# EasyEDA Pro project AWTRIX2.0_SHELD.eprj

# Schematic SHELD
Create Date: 2023-08-30; Page Name: P1; Project Name: AWTRIX2.0_SHELD; Schematic Name: SHELD; Update Date: 2023-10-06; Company: 🍊实验室; Drawed: CH; Page Size: A4; Version: V1.0
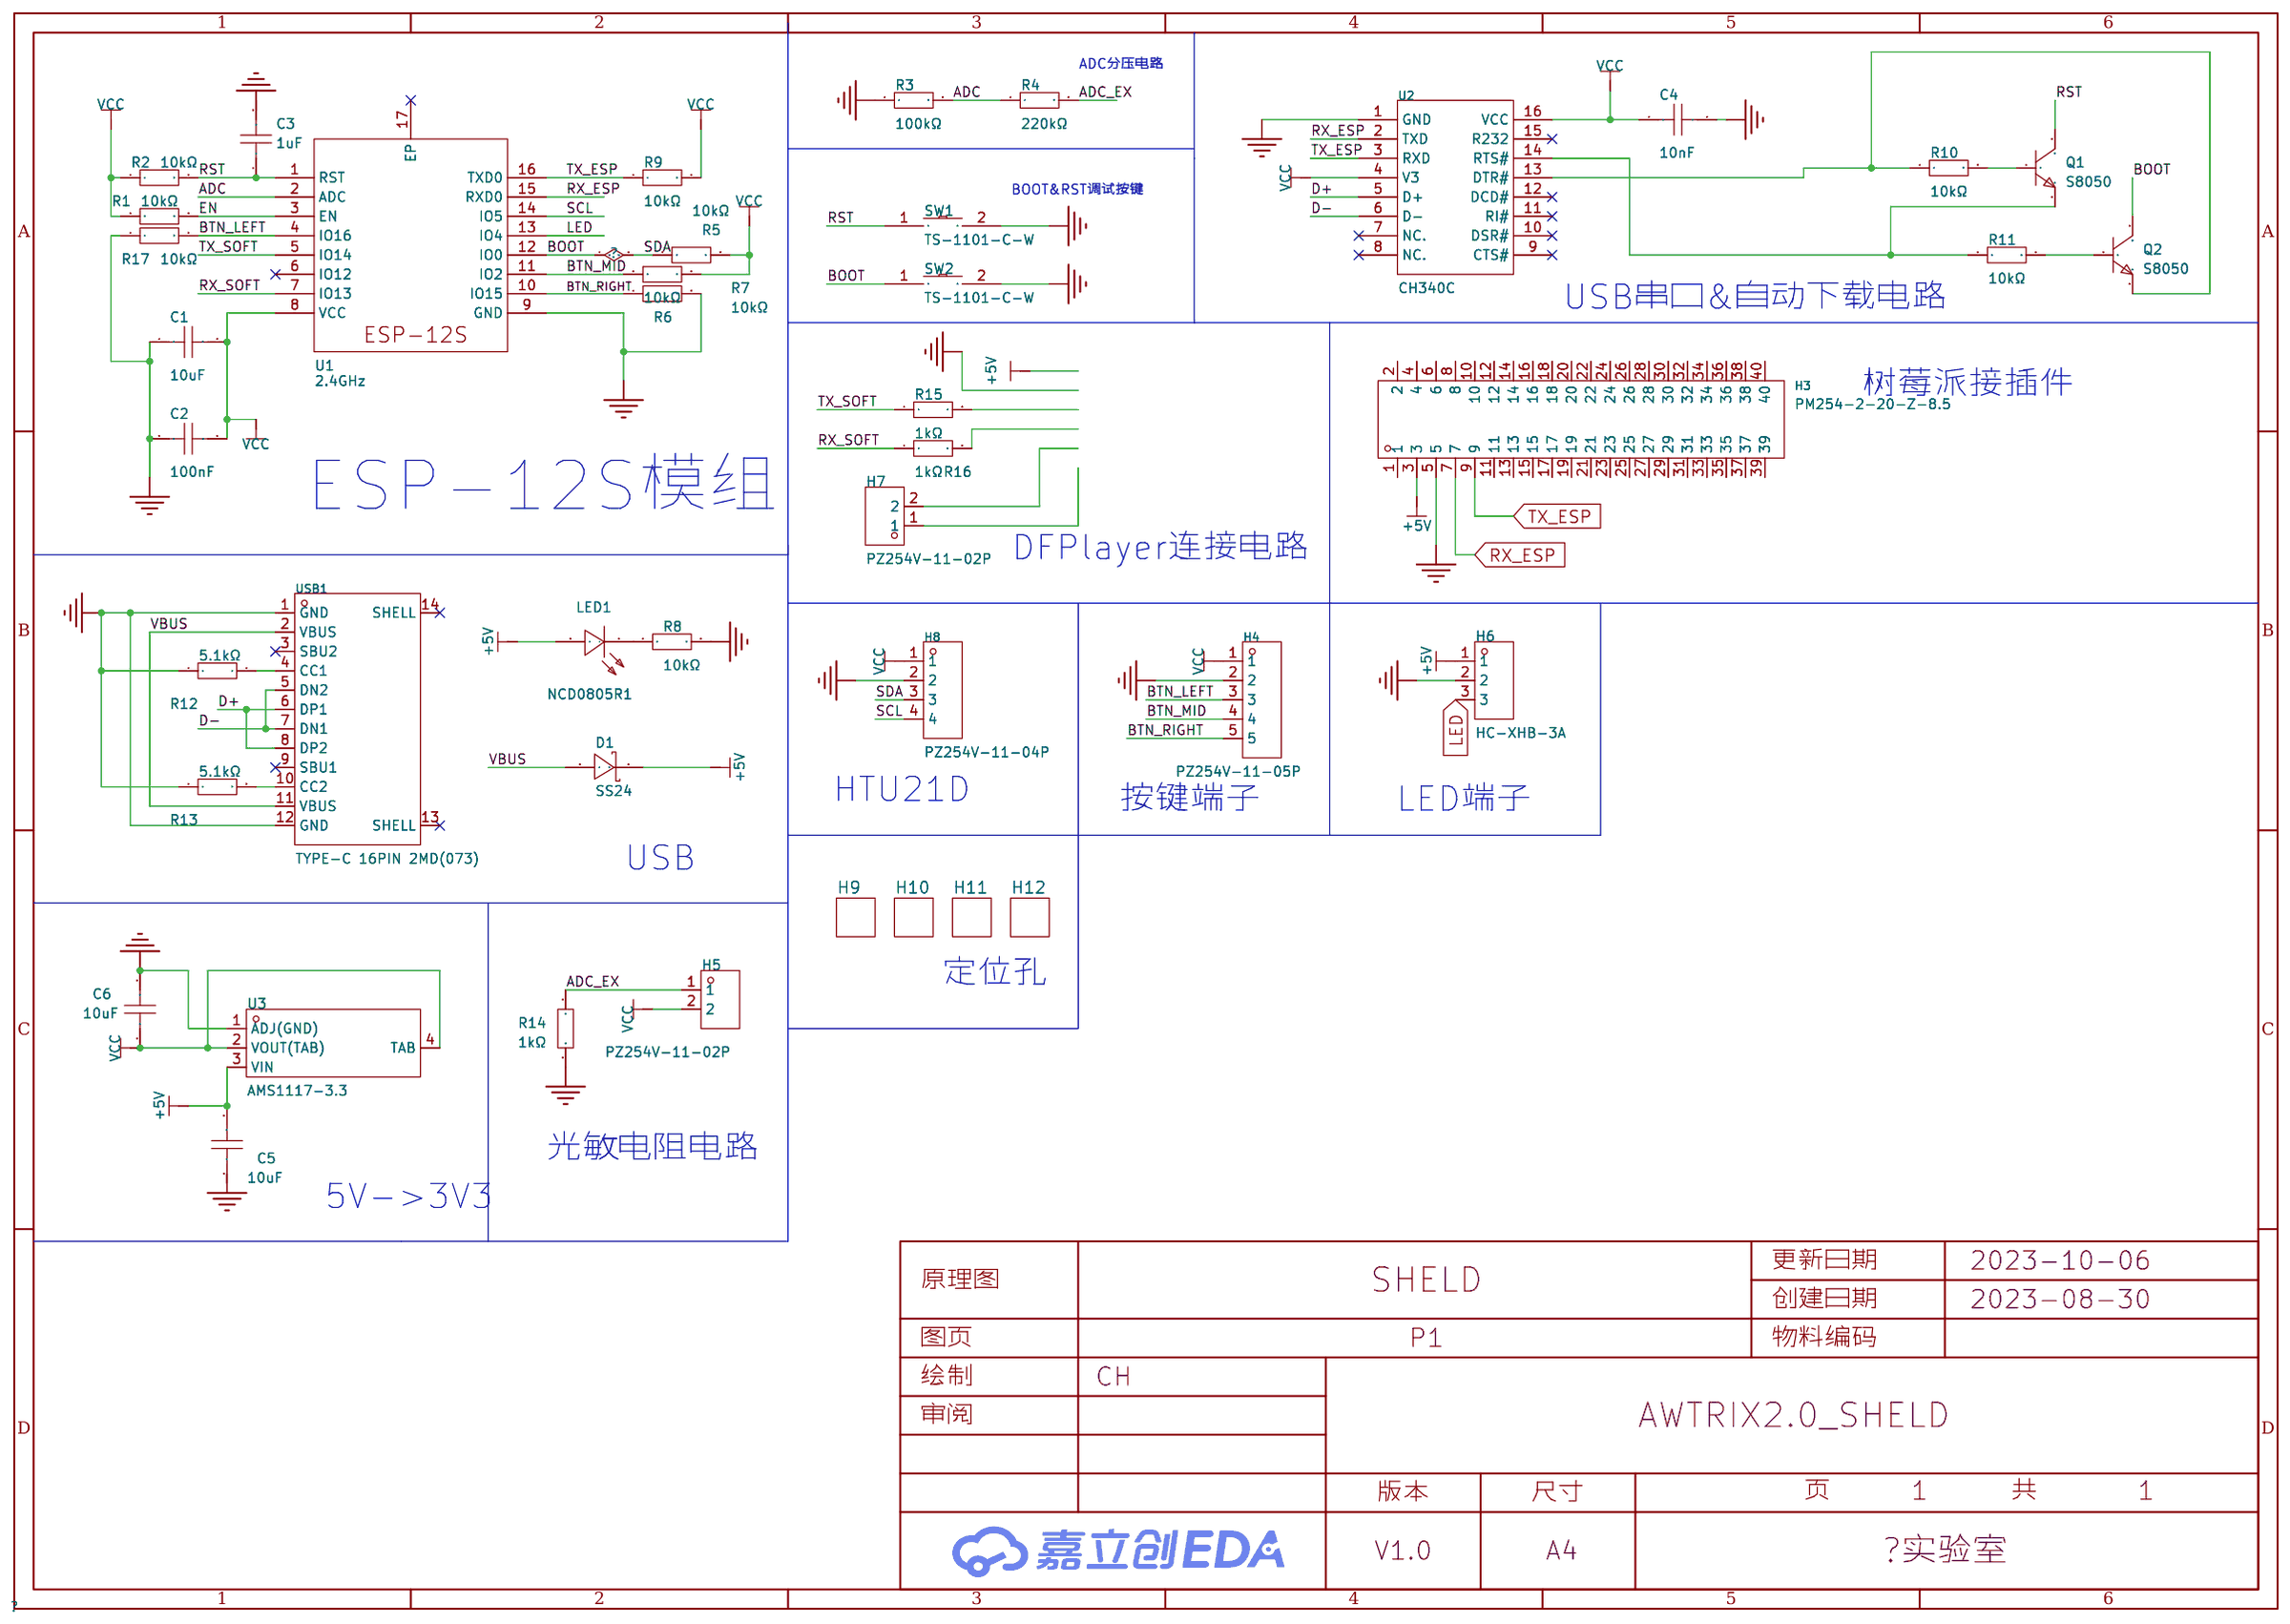
[diagram p0: schematic sheet]

## Parts
C1  10uF  [C0603]
C2  100nF  [C0603]
C3  1uF  [C0603]
C4  10nF  [C0603]
C5  10uF  [C0603]
C6  10uF  [C0603]
CBB1  9cfe7b9adb7f4373a9c1c3f971ab27d0
D1  SS24  [SMA_L4.3-W2.6-LS5.2-RD]
H3  PM254-2-20-Z-8.5  [HDR-TH_40P-P2.54-V-F-R2-C20-S2.54]
H4  PZ254V-11-05P  [HDR-TH_5P-P2.54-V-M]
H5  PZ254V-11-02P  [HDR-TH_2P-P2.54-V-M]
H6  HC-XHB-3A  [CONN-TH_3P-P2.50_HC-XHB-3AKK]
H7  PZ254V-11-02P  [HDR-TH_2P-P2.54-V-M]
H8  PZ254V-11-04P  [HDR-TH_4P-P2.54-V-M]
H9  Hole-3mm-JK 孔  [HOLE-3MM]
H10  Hole-3mm-JK 孔  [HOLE-3MM]
H11  Hole-3mm-JK 孔  [HOLE-3MM]
H12  Hole-3mm-JK 孔  [HOLE-3MM]
LED1  NCD0805R1  [LED0805-RD_RED]
Q1  S8050  [SOT-23-3_L2.9-W1.6-P1.90-LS2.8-BR]
Q2  S8050  [SOT-23-3_L2.9-W1.6-P1.90-LS2.8-BR]
R1  10kΩ  [R0603]
R2  10kΩ  [R0603]
R3  100kΩ  [R0603]
R4  220kΩ  [R0603]
R5  10kΩ  [R0603]
R6  10kΩ  [R0603]
R7  10kΩ  [R0603]
R8  10kΩ  [R0603]
R9  10kΩ  [R0603]
R10  10kΩ  [R0603]
R11  10kΩ  [R0603]
R12  5.1kΩ  [R0603]
R13  5.1kΩ  [R0603]
R14  1kΩ  [R0603]
R15  1kΩ  [R0603]
R16  1kΩ  [R0603]
R17  10kΩ  [R0603]
SW1  TS-1101-C-W  [SW-SMD_L6.0-W3.3-LS8.0]
SW2  TS-1101-C-W  [SW-SMD_L6.0-W3.3-LS8.0]
U1  2.4GHz  [WIRELM-SMD_ESP-12S]
U2  CH340C  [SOP-16_L10.0-W3.9-P1.27-LS6.0-BL]
U3  AMS1117-3.3  [SOT-223-4_L6.5-W3.5-P2.30-LS7.0-BR]
USB1  TYPE-C 16PIN 2MD(073)  [USB-C-SMD_TYPE-C-6PIN-2MD-073]

## Library data of the parts
C1 C5 C6 = CL10A106KP8NNNC: 容值:10uF;精度:±10%;额定电压:10V;材质(温度系数):X5R;; LCSC Part Name: 10uF ±10% 10V; Supplier Part: C19702; Manufacturer: SAMSUNG(三星); Supplier Footprint: 0603; JLCPCB Part Class: Basic Part; Datasheet: https://atta.szlcsc.com/upload/public/pdf/source/20160103/1457707703378.pdf; Supplier: LCSC; Tolerance: ±10%; Voltage Rated: 10V; Temperature Coefficient: X5R
C2 = 0603B104K500NT: 容值:100nF;精度:±10%;额定电压:50V;材质(温度系数):X7R;; LCSC Part Name: 100nF ±10% 50V; Supplier Part: C30926; Manufacturer: FH(风华); Supplier Footprint: 0603; JLCPCB Part Class: Extended Part; Datasheet: https://atta.szlcsc.com/upload/public/pdf/source/20170923/C30926_1506149436298988724.pdf; Supplier: LCSC; Tolerance: ±10%; Voltage Rated: 50V; Temperature Coefficient: X7R
C3 = CL10A105KB8NNNC: 容值:1uF;精度:±10%;额定电压:50V;材质(温度系数):X5R;; LCSC Part Name: 1uF ±10% 50V; Supplier Part: C15849; Manufacturer: SAMSUNG(三星); Supplier Footprint: 0603; JLCPCB Part Class: Basic Part; Datasheet: https://atta.szlcsc.com/upload/public/pdf/source/20160103/1457707679084.pdf; Supplier: LCSC; Tolerance: ±10%; Voltage Rated: 50V; Temperature Coefficient: X5R
C4 = CT41G-0603-2X1-50V-0.01μF-K(N): 容值:10nF;精度:±10%;额定电压:50V;材质(温度系数):2X1;; LCSC Part Name: 10nF ±10% 50V; Supplier Part: C136131; Manufacturer: TORCH(火炬); Supplier Footprint: 0603; JLCPCB Part Class: Extended Part; Datasheet: https://atta.szlcsc.com/upload/public/pdf/source/20180104/C136131_15150388659201227415.pdf; Supplier: LCSC; Tolerance: ±10%; Voltage Rated: 50V; Temperature Coefficient: 2X1
D1 = SS24_C50645: 直流反向耐压(Vr):40V;平均整流电流(Io):2A;正向压降(Vf):550mV@2A;; LCSC Part Name: 40V 2A 550mV@2A SMA （相似料：C364270）; Supplier Part: C50645; Manufacturer: MDD; Supplier Footprint: SMA(DO-214AC); JLCPCB Part Class: 扩展库; Datasheet: https://atta.szlcsc.com/upload/public/pdf/source/20190304/C50645_5B6F2047F1B1EB9F2588B24BC6E81306.pdf; Supplier: LCSC; Reverse Voltage (Vr): 40V; Average Rectified Current (Io): 2A; Forward Voltage (Vf@If): 550mV@2A
H3 = PM254-2-20-Z-8.5: 排数:双排;总孔位数:40;间距:2.54mm;插孔结构:2x20P;行距:2.54mm;安装类型:直插;圆孔/方孔:方孔;额定电流:3A;额定电压:-;插孔方向:顶部;塑高:8.5mm;工作温度范围:-40℃~+105℃;; LCSC Part Name: 2.54mm 2x20P; Supplier Part: C2897421; Manufacturer: HCTL(华灿天禄); Supplier Footprint: 插件,P=2.54mm; JLCPCB Part Class: Extended Part; Datasheet: 2022-08-29/478875C/7532653a59ec4ab7a85cccb09c462b49/2X20PIN排针.pdf; Supplier: LCSC; Number of Rows: 双排; Number of Holes: 40; Pitch: 2.54mm; Holes Structure: 2x20P; Row Spacing: 2.54mm; Mounting Type: 直插; Circular Hole / Square Hole: 方孔; Current Rating (Max): 3A; Holes Direction: 顶部; Insulation Height: 8.5mm; Operating Temperature Range: -40℃~+105℃; Number of Pins: 40; Pin Structure: 2x20P; Circluar Pins/Square Pins: 方针; Length of Mating Pin: 6mm; Length of End Connection Pin: 3mm; Color: 黑色
H4 = PZ254V-11-05P: 排数:单排;总PIN位数:5P;间距:2.54mm;插针结构:1x5P;行距:-;安装类型:直插;圆针/方针:方针;额定电流:-;额定电压:-;配合针长度:6mm;塑高:2.5mm;端接针长度:3mm;触头材质:黄铜;触头镀层:-;工作温度范围:-40℃~+105℃;颜色:黑色;; LCSC Part Name: 2.54mm 1x5P 直插 方针; Supplier Part: C492404; Manufacturer: XFCN(兴飞); Supplier Footprint: 插件,P=2.54mm; JLCPCB Part Class: Extended Part; Datasheet: https://atta.szlcsc.com/upload/public/pdf/source/20200309/C492404_E51533260F8710EFF5D4617281164C1D.pdf; Supplier: LCSC; Number of Rows: 单排; Number of Pins: 5P; Pitch: 2.54mm; Pin Structure: 1x5P; Mounting Type: 直插; Circluar Pins/Square Pins: 方针; Length of Mating Pin: 6mm; Insulation Height: 2.5mm; Length of End Connection Pin: 3mm; Contact Material: 黄铜; Operating Temperature Range: -40℃~+105℃; Color: 黑色
H5 H7 = PZ254V-11-02P: 排数:单排;总PIN位数:2P;间距:2.54mm;插针结构:1x2P;行距:-;安装类型:直插;圆针/方针:方针;额定电流:-;额定电压:-;配合针长度:6mm;塑高:2.5mm;端接针长度:3mm;触头材质:黄铜;触头镀层:-;工作温度范围:-40℃~+105℃;颜色:黑色;; LCSC Part Name: 2.54mm 1x2P 直插 方针; Supplier Part: C492401; Manufacturer: XFCN(兴飞); Supplier Footprint: 插件,P=2.54mm; JLCPCB Part Class: Extended Part; Datasheet: https://atta.szlcsc.com/upload/public/pdf/source/20200309/C492401_A812433581A9B211A7FFA413ADDFF0E5.pdf; Supplier: LCSC; Number of Rows: 单排; Number of Pins: 2P; Pitch: 2.54mm; Pin Structure: 1x2P; Mounting Type: 直插; Circluar Pins/Square Pins: 方针; Length of Mating Pin: 6mm; Insulation Height: 2.5mm; Length of End Connection Pin: 3mm; Contact Material: 黄铜; Operating Temperature Range: -40℃~+105℃; Color: 黑色
H6 = HC-XHB-3A: 间距:2.5mm;插针结构:1x3P;排数:1;每排PIN数:3;公母:公型插针;安装方式:直插;额定电流:3A;工作温度范围:-25℃~+85℃;; LCSC Part Name: 2.5mm 1x3P 直插 带锁扣立式插件 3P; Supplier Part: C3011963; Manufacturer: HCTL(华灿天禄); Supplier Footprint: 插件,P=2.5mm; JLCPCB Part Class: Extended Part; Datasheet: https://atta.szlcsc.com/upload/public/pdf/source/20210728/C2845490_C6E0123D5C5ECC46C6D4C91ADB43F484.pdf; Supplier: LCSC; Pitch: 2.5mm; Pins Structure: 1x3P; Number of Rows: 1; Number of PINs Per Row: 3; Gender: 公型插针; Mounting Style: 直插; Current Rating (Max): 3A; Operating Temperature Range: -25℃~+85℃; Reference Series: VH
H8 = PZ254V-11-04P: 排数:单排;总PIN位数:4P;间距:2.54mm;插针结构:1x4P;行距:-;安装类型:直插;圆针/方针:方针;额定电流:3A;额定电压:250V;配合针长度:6mm;塑高:2.5mm;端接针长度:3mm;触头材质:-;工作温度范围:-40℃~+105℃;颜色:黑色;; LCSC Part Name: 2.54mm 1x4P 直插 方针; Supplier Part: C2691448; Manufacturer: XFCN(兴飞); Supplier Footprint: 插件,P=2.54mm; JLCPCB Part Class: Extended Part; Datasheet: https://atta.szlcsc.com/upload/public/pdf/source/20200309/C492403_F9F19131791D08044AD4F84F8E751A34.pdf; Supplier: LCSC; Number of Rows: 单排; Number of Pins: 4P; Pitch: 2.54mm; Pin Structure: 1x4P; Mounting Type: 直插; Circluar Pins/Square Pins: 方针; Current Rating (Max): 3A; Voltage Rating (Max): 250V; Length of Mating Pin: 6mm; Insulation Height: 2.5mm; Length of End Connection Pin: 3mm; Operating Temperature Range: -40℃~+105℃; Color: 黑色
H9-H12 = Hole-3mm-JK 孔: Manufacturer Part: Hole-3mm; Check: false
LED1 = NCD0805R1: 发光颜色:红灯;; LCSC Part Name: 红灯; Supplier Part: C84256; Manufacturer: 国星光电; Supplier Footprint: 0805; JLCPCB Part Class: 基础库; Datasheet: https://atta.szlcsc.com/upload/public/pdf/source/20200820/C84256_F0A75A43B3EAD75808600A0514C76B99.pdf; Supplier: LCSC; Emitted Color: 红灯
Q1 Q2 = S8050_C181158: 晶体管类型:NPN;集射极击穿电压(Vceo):25V;集电极电流(Ic):500mA;功率(Pd):300mW;; LCSC Part Name: NPN 25V 500mA; Supplier Part: C181158; Manufacturer: Hottech(合科泰); Supplier Footprint: SOT-23; JLCPCB Part Class: 扩展库; Datasheet: https://atta.szlcsc.com/upload/public/pdf/source/20220506/D987F39D56F2975D34EC7947E75C4ABC.pdf; Supplier: LCSC; Transistor Type: NPN; Collector-Emitter Breakdown Voltage (Vceo): 25V; Collector Current (Ic): 500mA; Power Dissipation (Pd): 300mW; Collector Cut-Off Current (Icbo): 100nA; Collector-Emitter Saturation Voltage (VCE(sat)@Ic,Ib): 600mV@500mA,50mA; Transition Frequency (fT): 150MHz; Operating Temperature: +150℃@(Tj)
R1 R2 R5-R11 R17 = 0603WAF1002T5E: 电阻类型:厚膜电阻;阻值:10kΩ;精度:±1%;功率:100mW;; LCSC Part Name: 厚膜电阻 10kΩ ±1% 100mW; Supplier Part: C25804; Manufacturer: UNI-ROYAL(厚声); Supplier Footprint: 0603; JLCPCB Part Class: Basic Part; Datasheet: https://atta.szlcsc.com/upload/public/pdf/source/20200306/C422600_1E6D84923E4A46A82E41ADD87F860B5C.pdf; Supplier: LCSC; Type: 厚膜电阻; Tolerance: ±1%; Power(Watts): 100mW; Temperature Coefficient: ±100ppm/℃; Overload Voltage (Max): 75V; Operating Temperature Range: -55℃~+155℃
R3 = 0603WAF1003T5E: 电阻类型:厚膜电阻;阻值:100kΩ;精度:±1%;功率:100mW;; LCSC Part Name: 100kΩ ±1% 100mW; Supplier Part: C25803; Manufacturer: UNI-ROYAL(厚声); Supplier Footprint: 0603; JLCPCB Part Class: Basic Part; Datasheet: https://atta.szlcsc.com/upload/public/pdf/source/20200306/C422600_1E6D84923E4A46A82E41ADD87F860B5C.pdf; Supplier: LCSC; Type: 厚膜电阻; Tolerance: ±1%; Power(Watts): 100mW; Temperature Coefficient: ±100ppm/℃; Overload Voltage (Max): 75V; Operating Temperature Range: -55℃~+155℃
R4 = 0603WAF2203T5E: 电阻类型:厚膜电阻;阻值:220kΩ;精度:±1%;功率:100mW;; LCSC Part Name: 220kΩ ±1% 100mW; Supplier Part: C22961; Manufacturer: UNI-ROYAL(厚声); Supplier Footprint: 0603; JLCPCB Part Class: Basic Part; Datasheet: https://atta.szlcsc.com/upload/public/pdf/source/20200306/C422600_1E6D84923E4A46A82E41ADD87F860B5C.pdf; Supplier: LCSC; Type: 厚膜电阻; Tolerance: ±1%; Power(Watts): 100mW; Temperature Coefficient: ±100ppm/℃; Overload Voltage (Max): 75V; Operating Temperature Range: -55℃~+155℃
R12 R13 = 0603WAF5101T5E: 电阻类型:厚膜电阻;阻值:5.1kΩ;精度:±1%;功率:100mW;; LCSC Part Name: 5.1kΩ ±1% 100mW; Supplier Part: C23186; Manufacturer: UNI-ROYAL(厚声); Supplier Footprint: 0603; JLCPCB Part Class: Basic Part; Datasheet: https://atta.szlcsc.com/upload/public/pdf/source/20200306/C422600_1E6D84923E4A46A82E41ADD87F860B5C.pdf; Supplier: LCSC; Type: 厚膜电阻; Tolerance: ±1%; Power(Watts): 100mW; Temperature Coefficient: ±100ppm/℃; Overload Voltage (Max): 75V; Operating Temperature Range: -55℃~+155℃
R14-R16 = 0603WAF1001T5E: 电阻类型:厚膜电阻;阻值:1kΩ;精度:±1%;功率:100mW;; LCSC Part Name: 1kΩ ±1% 100mW; Supplier Part: C21190; Manufacturer: UNI-ROYAL(厚声); Supplier Footprint: 0603; JLCPCB Part Class: Basic Part; Datasheet: https://atta.szlcsc.com/upload/public/pdf/source/20200306/C422600_1E6D84923E4A46A82E41ADD87F860B5C.pdf; Supplier: LCSC; Type: 厚膜电阻; Tolerance: ±1%; Power(Watts): 100mW; Temperature Coefficient: ±100ppm/℃; Overload Voltage (Max): 75V; Operating Temperature Range: -55℃~+155℃
SW1 SW2 = TS-1101-C-W: 触点电流:50mA;额定电压(AC):-;额定电压(DC):12V;额定功率:-;绝缘电阻:-;电路结构:单刀单掷;安装方式:立贴;带灯:无;作用力:260gf;机械寿命:5万次;带支架:否;; LCSC Part Name: 立贴 6*3.6*2.5mm 轻触开关 一型3*6*2.5有白ZD b拉伸白色带淡绿按键 卷装; Supplier Part: C318938; Manufacturer: XKB Connectivity(中国星坤); Supplier Footprint: SMD; JLCPCB Part Class: 扩展库; Datasheet: https://atta.szlcsc.com/upload/public/pdf/source/20200227/C318938_C2E53B1EEDE37D980A33616AC086DE53.pdf; Supplier: LCSC; Contact Current: 50mA; Voltage Rating (DC): 12V; Circuit: 单刀单掷; Mounting Style: 立贴; Actuator Style: 矩形按钮; Actuator/Cap Color: 白色带淡绿; With Lamp: 无; Operating Force: 260gf; Mechanical Life: 5万次; Operating Temperature: -30℃~+85℃; Switch Length: 6mm; Switch Width: 3.6mm; Switch Height: 2.5mm; Strike Gundam: 否
U1 = ESP-12S: 频率:2.4GHz;发射功率:16dBm;核心处理器:ESP32;天线形式:PCB 板载天线;接收灵敏度:-90dBm;; Supplier Part: C82898; Manufacturer: Ai-Thinker(安信可); Supplier Footprint: SMD,16x24mm; JLCPCB Part Class: 扩展库; Datasheet: https://atta.szlcsc.com/upload/public/pdf/source/20180726/C82898_9FA1708C134FC93491C81360A8B073B0.pdf; Supplier: LCSC; Output Power: 16dBm; Core Processor: ESP32; Support Interface: GPIO；UART；PWM；ADC; Antenna Type: PCB 板载天线; Wireless Standard: 802.11b/g/n; Operating Voltage: 3.3V; Receive  Current: 56mA; Send  Current: 170mA; Sensitivity: -90dBm; Operating Temperature: -20℃~+85℃
U2 = CH340C: 应用功能:收发器;接口协议:USB 2.0;数据速率:2Mbps;; LCSC Part Name: CH340C USB转串口芯片 CH340; Supplier Part: C84681; Manufacturer: WCH(南京沁恒); Supplier Footprint: SOP-16; JLCPCB Part Class: 扩展库; Datasheet: https://atta.szlcsc.com/upload/public/pdf/source/20200819/C84681_ADBED554CE321879DBD6B1D06488689C.pdf; Supplier: LCSC; Applications Function: 收发器; Protocol: USB 2.0; Data Rate: 2Mbps; Supply Voltage: 3.3V；5V
U3 = AMS1117-3.3_C347222: 输出类型:固定;输出极性:正;最大输入电压:18V;输出电压:3.3V;输出电流:1A;电源纹波抑制比(PSRR):60dB@(120Hz);; Supplier Part: C347222; Manufacturer: UMW(广东友台半导体); Supplier Footprint: SOT-223; JLCPCB Part Class: 扩展库; Datasheet: https://atta.szlcsc.com/upload/public/pdf/source/20211011/50CC665C22E3A66C08379A4A74BDA25C.pdf; Supplier: LCSC; Output Type: 固定; Output Polarity: 正; Number of Outputs: 1; Maximum Input Voltage: 18V; Output Voltage: 3.3V; Dropout Voltage: 1.3V@(1A); Output Current: 1A; Power Supply Rejection Ratio (PSRR): 60dB@(120Hz)
USB1 = TYPE-C 16PIN 2MD(073): 连接器类型:Type-C;标准:-;公母:母座;触点数量:16;端口数量:1;安装方式:卧贴;额定电流 - 电源:5A;工作温度范围:-25℃~+85℃;; LCSC Part Name: TYPE-C母座 16P 4脚插件带定位柱 不锈钢外壳 2次模顶; Supplier Part: C2765186; Manufacturer: SHOU HAN(首韩); Supplier Footprint: SMD; JLCPCB Part Class: 扩展库; Supplier: LCSC; Connector Type: Type-C; Gender: 母座; Number of Contacts: 16; Number of Ports: 1; Mounting Style: 卧贴; Current Rating - Power (Max): 5A; Operating Temperature Range: -25℃~+85℃

## Nets
+5V: C5.2 CBB1.1(VCC) D1.1(K) H3.3 H6.1 LED1.2(+) U3.3(VIN)
GND: C1.1 C2.1 C3.2 C4.2 C5.1 C6.2 CBB1.2(GND) H3.5 H4.2 H6.2 H8.2 R3.1 R6.2 R8.2 R12.1 R13.1 R14.2 R17.1 SW1.2 SW2.2 U1.9(GND) U2.1(GND) U3.1(ADJ(GND)) USB1.1(GND) USB1.12(GND)
VBUS: D1.2(A) USB1.2(VBUS) USB1.11(VBUS)
VCC: C1.2 C2.2 C4.1 C6.1 H4.1 H5.2 H8.1 R1.1 R2.1 R5.2 R7.2 R9.2 U1.8(VCC) U2.4(V3) U2.16(VCC) U3.2(VOUT(TAB)) U3.4(TAB)
ADC: R3.2 R4.1 U1.2(ADC)
ADC_EX: H5.1 R4.2 R14.1
BOOT: H8.3 Q2.3 R5.1 SW2.1 U1.12(IO0)
BTN_LEFT: H4.3 R17.2 U1.4(IO16)
BTN_MID: H4.4 R7.1 U1.11(IO2)
BTN_RIGHT: H4.5 R6.1 U1.10(IO15)
D+: U2.5(D+) USB1.6(DP1) USB1.8(DP2)
D-: U2.6(D-) USB1.5(DN2) USB1.7(DN1)
EN: R1.2 U1.3(EN)
LED: H6.3 U1.13(IO4)
RST: C3.1 Q1.3 R2.2 SW1.1 U1.1(RST)
RX_ESP: H3.7 U1.15(RXD0) U2.2(TXD)
RX_SOFT: R16.1 U1.7(IO13)
SCL: H8.4 U1.14(IO5)
TX_ESP: H3.9 R9.1 U1.16(TXD0) U2.3(RXD)
TX_SOFT: R15.1 U1.5(IO14)
$1N2237: Q1.2 R11.1 U2.14(RTS#)
$1N2263: Q2.2 R10.1 U2.13(DTR#)
$1N2841: Q1.1 R10.2
$1N2976: Q2.1 R11.2
$1N3870: R12.2 USB1.4(CC1)
$1N3955: R13.2 USB1.10(CC2)
Net-(CBB1-3): CBB1.3(RX) R15.2
Net-(CBB1-4): CBB1.4(TX) R16.2
Net-(CBB1-5): CBB1.5(SPK_1) H7.2
Net-(CBB1-6): CBB1.6(SPK_2) H7.1
Net-(LED1-1): LED1.1(-) R8.1

Not connected (* = marked no-connect by the designer): H3 1 2 4 6 8 10 11 12 13 14 15 16 17 18 19 20 21 22 23 24 25 26 27 28 29 30 31 32 33 34 35 36 37 38 39 40; U1 6(IO12)* 17(EP)*; U2 7(NC.)* 8(NC.)* 9(CTS#)* 10(DSR#)* 11(RI#)* 12(DCD#)* 15(R232)*; USB1 3(SBU2)* 9(SBU1)* 13(SHELL)* 14(SHELL)*

## Notes on the sheet
- ADC分压电路
- BOOT&RST调试按键
- USB串口&自动下载电路
- 树莓派接插件
- ESP-12S模组
- DFPlayer连接电路
- HTU21D
- 按键端子
- LED端子
- USB
- 定位孔
- 光敏电阻电路
- 5V->3V3

# Schematic DFPlayer
Page Name: P1; Project Name: AWTRIX2.0_SHELD; Schematic Name: DFPlayer; Company: 嘉立创EDA; Page Size: A4; Version: V1.0
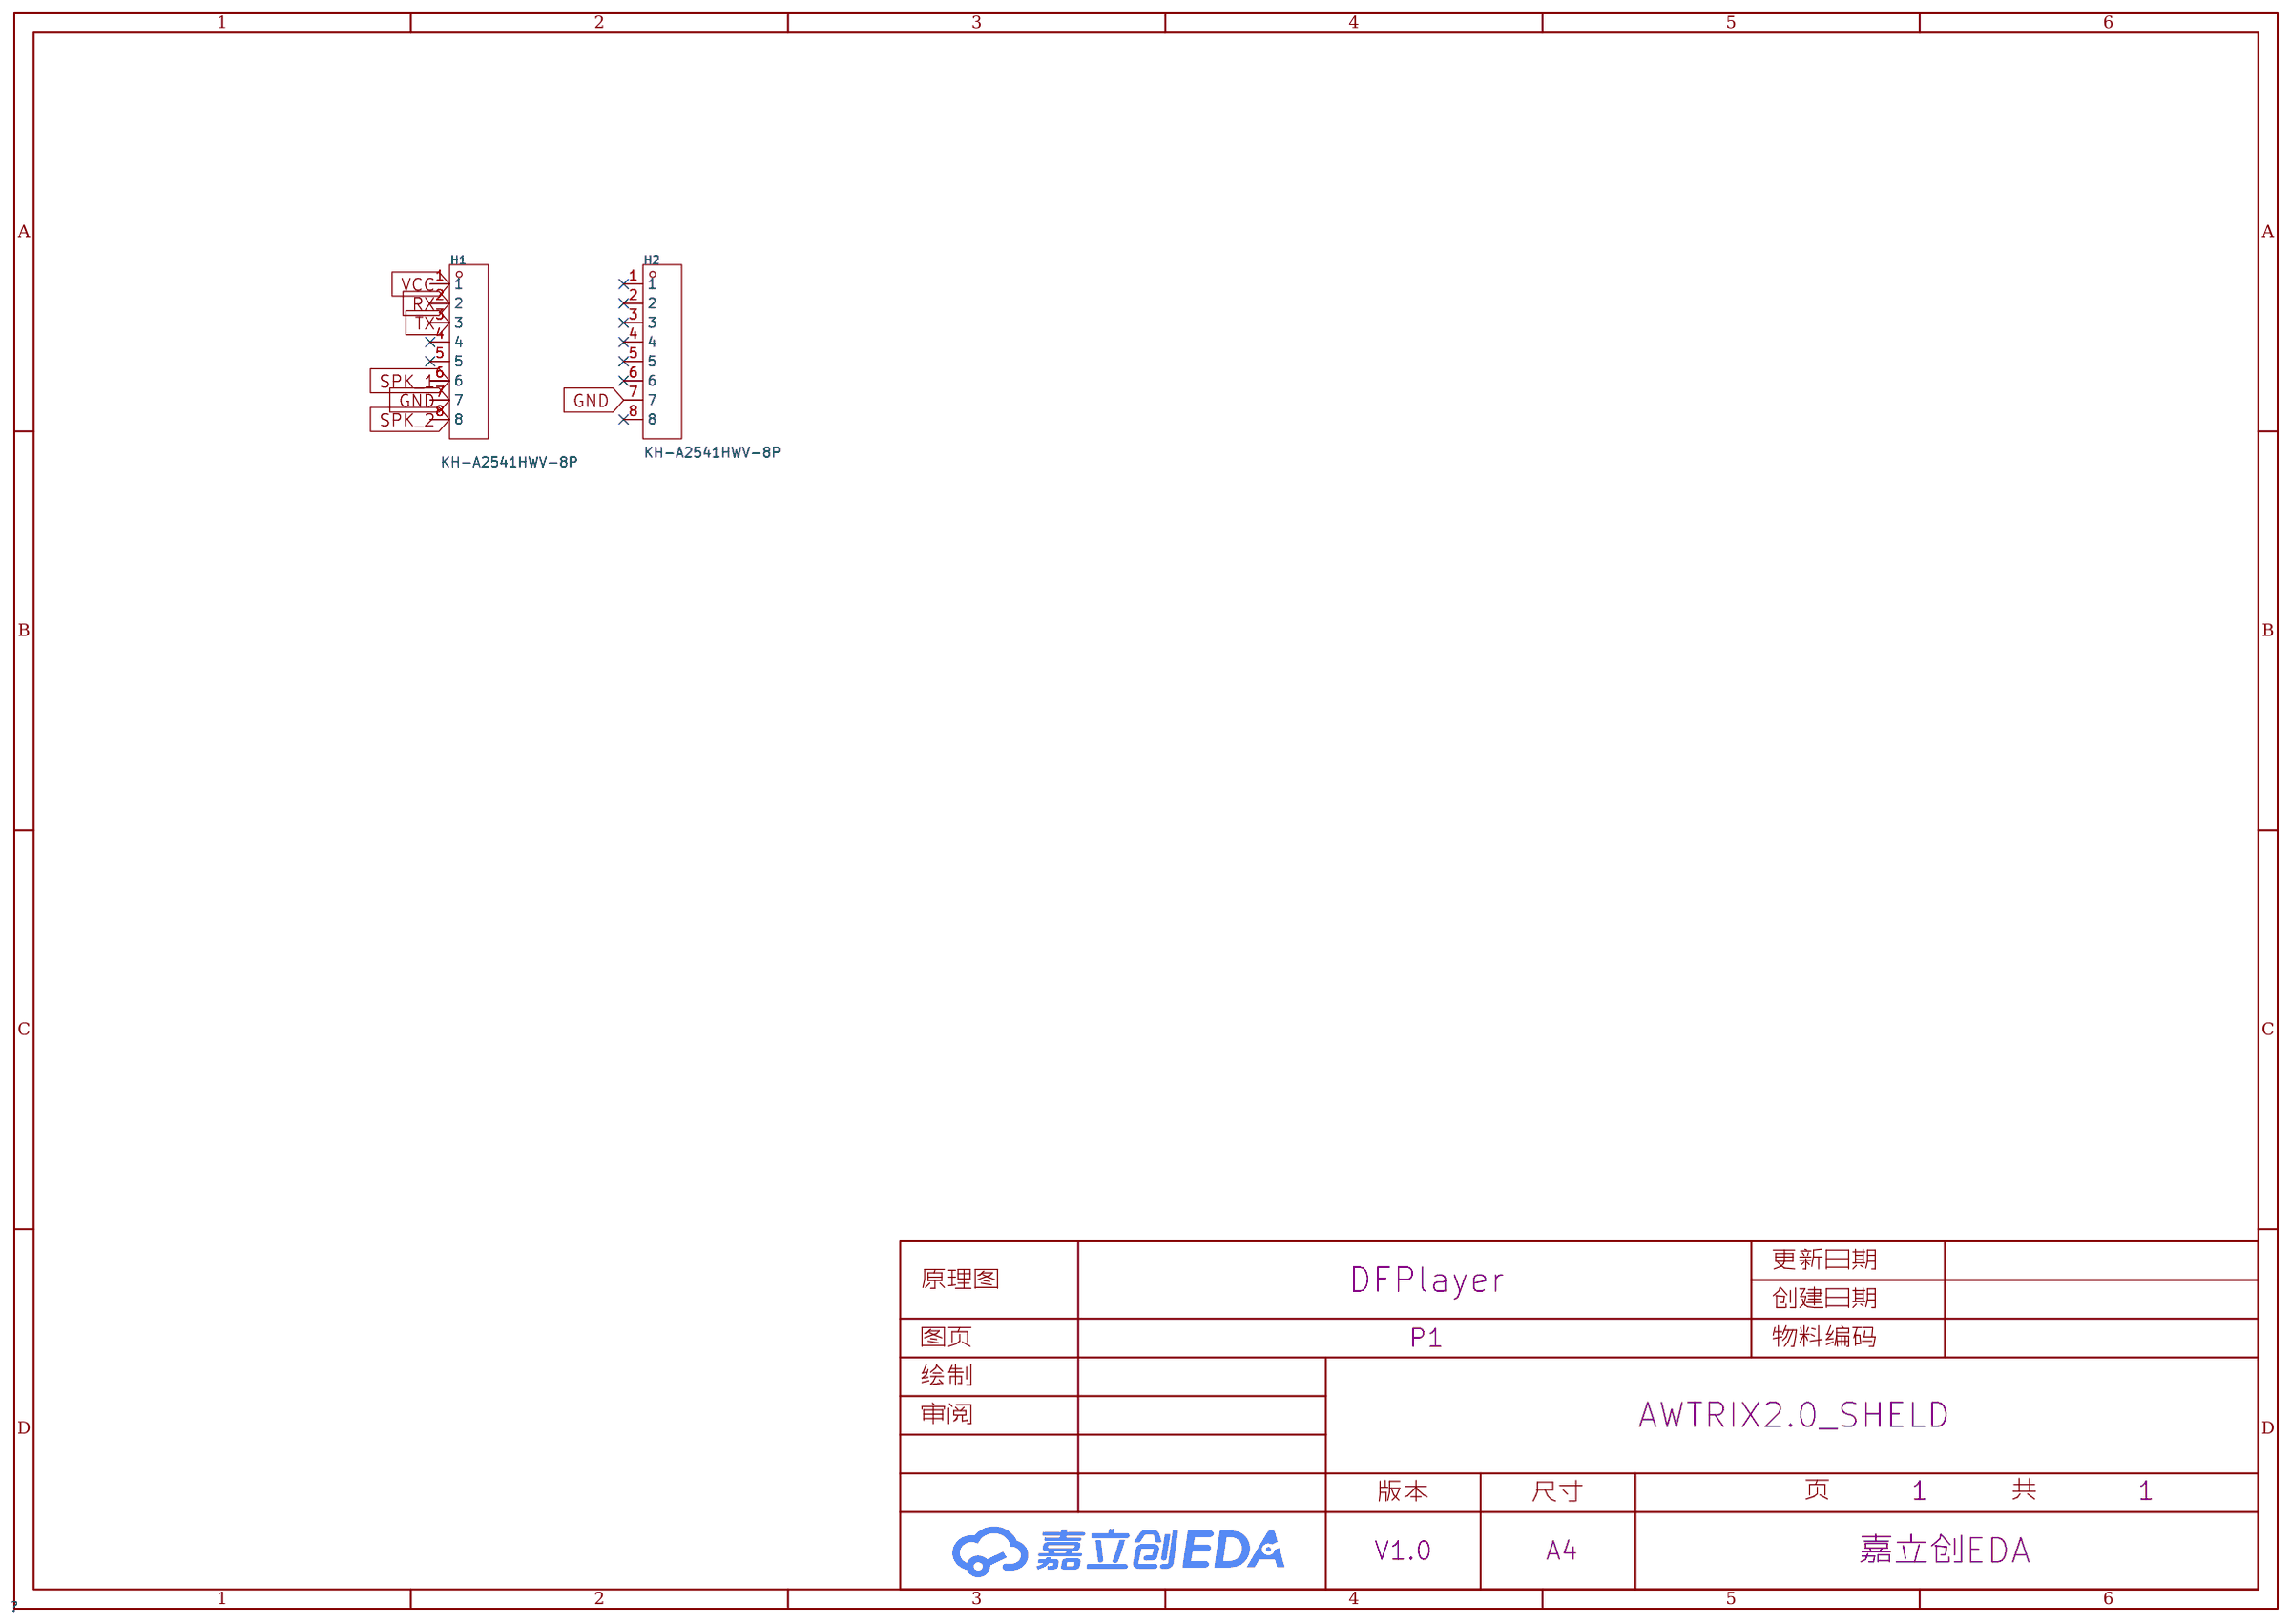
[diagram p1: schematic sheet]

## Parts
H1  KH-A2541HWV-8P  [HDR-TH_8P-P2.54-V-F]
H2  KH-A2541HWV-8P  [HDR-TH_8P-P2.54-V-F]

## Library data of the parts
H1 H2 = KH-A2541HWV-8P: 排数:单排;总孔位数:8P;间距:2.54mm;插孔结构:1x8P;行距:-;安装类型:直插;圆孔/方孔:方孔;额定电流:3A;额定电压:250V;插孔方向:顶部;工作温度范围:-40℃~+105℃;; LCSC Part Name: 2.54mm 1x8P; Supplier Part: C2833314; Manufacturer: kinghelm(金航标); Supplier Footprint: 插件,P=2.54mm; JLCPCB Part Class: 扩展库; Datasheet: https://atta.szlcsc.com/upload/public/pdf/source/20210520/C2833314_9EB5E0678BEF41539E47467DCA6AE6E3.pdf; Supplier: LCSC; Number of Rows: 单排; Number of Holes: 8P; Pitch: 2.54mm; Holes Structure: 1x8P; Mounting Type: 直插; Circular Hole / Square Hole: 方孔; Current Rating (Max): 3A; Voltage Rating (Max): 250V; Holes Direction: 顶部; Operating Temperature Range: -40℃~+105℃

## Nets
GND: H1.7 H2.7
VCC: H1.1
RX: H1.2
SPK_1: H1.6
SPK_2: H1.8
TX: H1.3

Not connected (* = marked no-connect by the designer): H1 4* 5*; H2 1* 2* 3* 4* 5* 6* 8*

# Schematic BUTTON_BOARD
Create Date: 2023-09-06; Page Name: P1; Project Name: AWTRIX2.0_SHELD; Schematic Name: BUTTON_BOARD; Update Date: 2023-09-06; Company: 嘉立创EDA; Page Size: A4; Version: V1.0
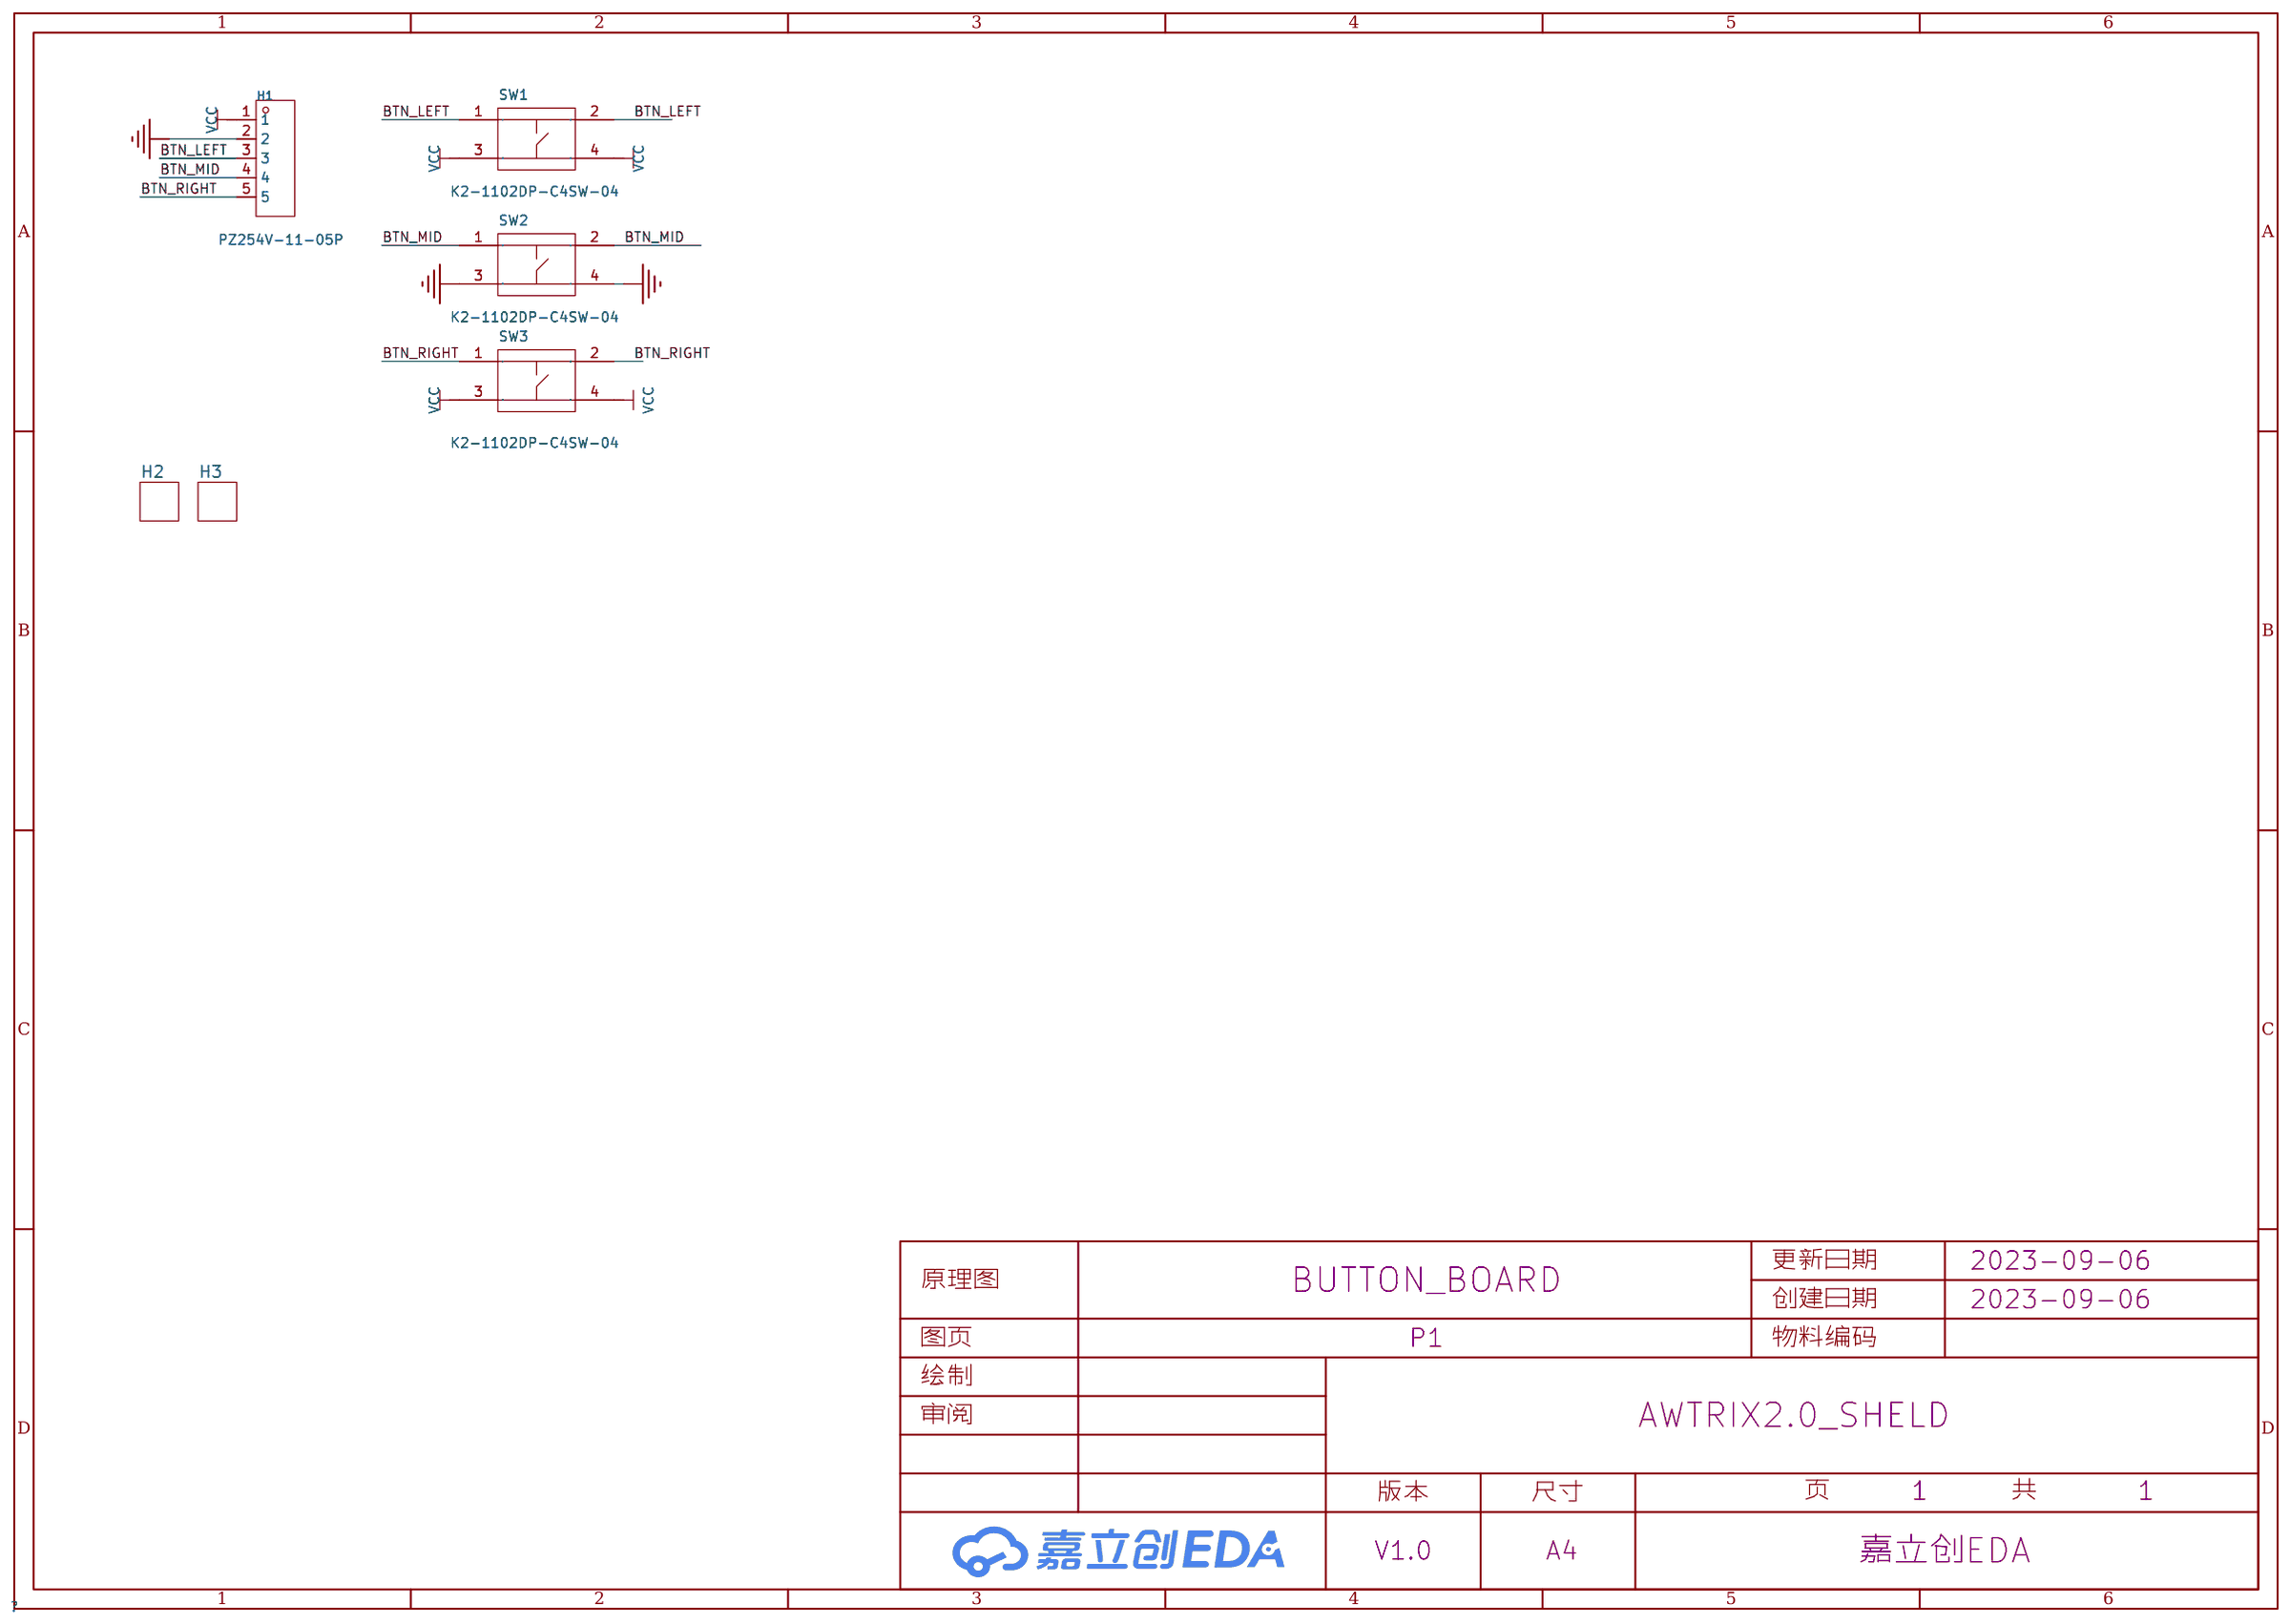
[diagram p2: schematic sheet]

## Parts
H1  PZ254V-11-05P  [HDR-TH_5P-P2.54-V-M]
H2  Hole-3mm-JK 孔  [HOLE-3MM]
H3  Hole-3mm-JK 孔  [HOLE-3MM]
SW1  K2-1102DP-C4SW-04  [KEY-TH_4P-L6.0-W6.0-P4.50-LS6.5]
SW2  K2-1102DP-C4SW-04  [KEY-TH_4P-L6.0-W6.0-P4.50-LS6.5]
SW3  K2-1102DP-C4SW-04  [KEY-TH_4P-L6.0-W6.0-P4.50-LS6.5]

## Library data of the parts
H1 = PZ254V-11-05P: 排数:单排;总PIN位数:5P;间距:2.54mm;插针结构:1x5P;行距:-;安装类型:直插;圆针/方针:方针;额定电流:-;额定电压:-;配合针长度:6mm;塑高:2.5mm;端接针长度:3mm;触头材质:黄铜;触头镀层:-;工作温度范围:-40℃~+105℃;颜色:黑色;; LCSC Part Name: 2.54mm 1x5P 直插 方针; Supplier Part: C492404; Manufacturer: XFCN(兴飞); Supplier Footprint: 插件,P=2.54mm; JLCPCB Part Class: Extended Part; Datasheet: https://atta.szlcsc.com/upload/public/pdf/source/20200309/C492404_E51533260F8710EFF5D4617281164C1D.pdf; Supplier: LCSC; Number of Rows: 单排; Number of Pins: 5P; Pitch: 2.54mm; Pin Structure: 1x5P; Mounting Type: 直插; Circluar Pins/Square Pins: 方针; Length of Mating Pin: 6mm; Insulation Height: 2.5mm; Length of End Connection Pin: 3mm; Contact Material: 黄铜; Operating Temperature Range: -40℃~+105℃; Color: 黑色
H2 H3 = Hole-3mm-JK 孔: Manufacturer Part: Hole-3mm
SW1-SW3 = K2-1102DP-C4SW-04: 触点电流:50mA;额定电压(DC):12V;绝缘电阻:100MΩ;电路结构:单刀单掷;安装方式:直插;按钮形状:圆形按钮;带灯:-;作用力:250gf@±30gf;机械寿命:100000;工作温度:-25℃~+85℃;开关长度:6mm;开关宽度:6mm;开关高度:5mm;; LCSC Part Name: 轻触按键开关6*6*5; Supplier Part: C110153; Manufacturer: 韩国韩荣; Supplier Footprint: 插件; JLCPCB Part Class: 扩展库; Datasheet: https://atta.szlcsc.com/upload/public/pdf/source/20210810/D0CD9D77408EACA829A5E533AC6E5B1E.pdf; Supplier: LCSC; Contact Current: 50mA; Voltage Rating (DC): 12V; Insulation Resistance: 100MΩ; Circuit: 单刀单掷; Mounting Style: 直插; Actuator Style: 圆形按钮; Operating Force: 250gf@±30gf; Mechanical Life: 100000; Operating Temperature: -25℃~+85℃; Switch Length: 6mm; Switch Width: 6mm; Switch Height: 5mm

## Nets
GND: H1.2 SW2.3 SW2.4
VCC: H1.1 SW1.3 SW1.4 SW3.3 SW3.4
BTN_LEFT: H1.3 SW1.1 SW1.2
BTN_MID: H1.4 SW2.1 SW2.2
BTN_RIGHT: H1.5 SW3.1 SW3.2

# Board DFPlayer
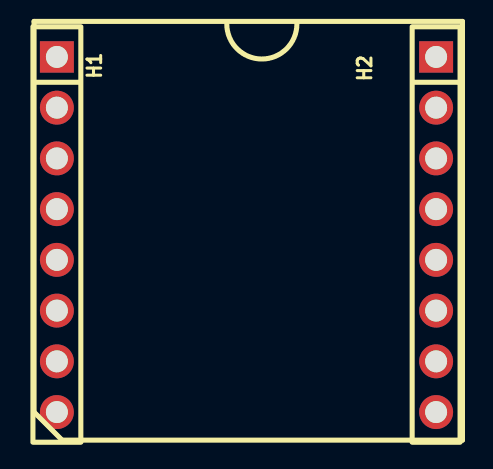
[diagram p3: board, top side]
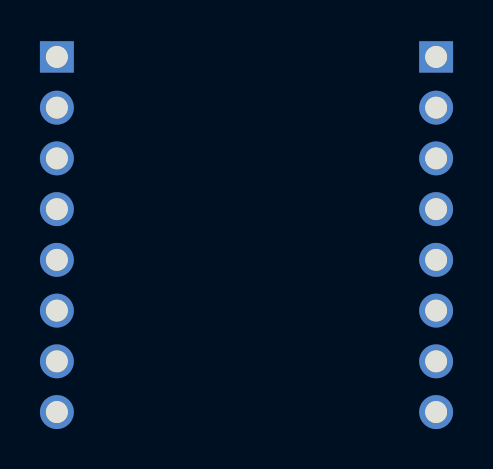
[diagram p4: board, bottom side, seen from below]

No outline. copper layers: Top Layer, Bottom Layer. Coordinates in mm from the lowest, leftmost part position.
Stack: Top Layer 0.035mm / Dielectric1 1.51mm FR4 er 4.5 / Bottom Layer 0.035mm

## Design rules (mm)
template: JLCPCB Capability(Two Layers Board)
spacing copperThickness1oz (default): track to track 0.102, other pairs 0.152 to 0.3
spacing copperThickness2oz: track to track 0.203, other pairs 0.152 to 0.3
track width copperThickness1oz (default): min 0.127, default 0.254, max 2.54
track width copperThickness2oz: min 0.203, default 0.254, max 2.54
differential pair differentialPair (default): width min 0.127, default 0.254, max 2.54; gap min 0.152, default 0.152
via viaSize (default): diameter min 0.5, default 0.61, max 10; hole min 0.3, default 0.305, max 6.3

## Placement (name value [footprint] x y rotation side)
H1  KH-A2541HWV-8P  [HDR-TH_8P-P2.54-V-F]  0 0 270 top
H2  KH-A2541HWV-8P  [HDR-TH_8P-P2.54-V-F]  19 0 270 top

## Footprints (pads in the part's own frame, mm; a bottom-side part is the same pattern mirrored in y, then rotated)
HDR-TH_8P-P2.54-V-F
  rect 1.575x1.7 hole 1.1: 1(-8.89,0)
  round 1.7 hole 1.1: 2(-6.35,0) 3(-3.81,0) 4(-1.27,0) 5(1.27,0) 6(3.81,0) 7(6.35,0) 8(8.89,0)

## Nets
As in the schematic.

Pads without a net: H1 1 2 3 4 5 6 7 8; H2 1 2 3 4 5 6 7 8

# Board BUTTON_BOARD
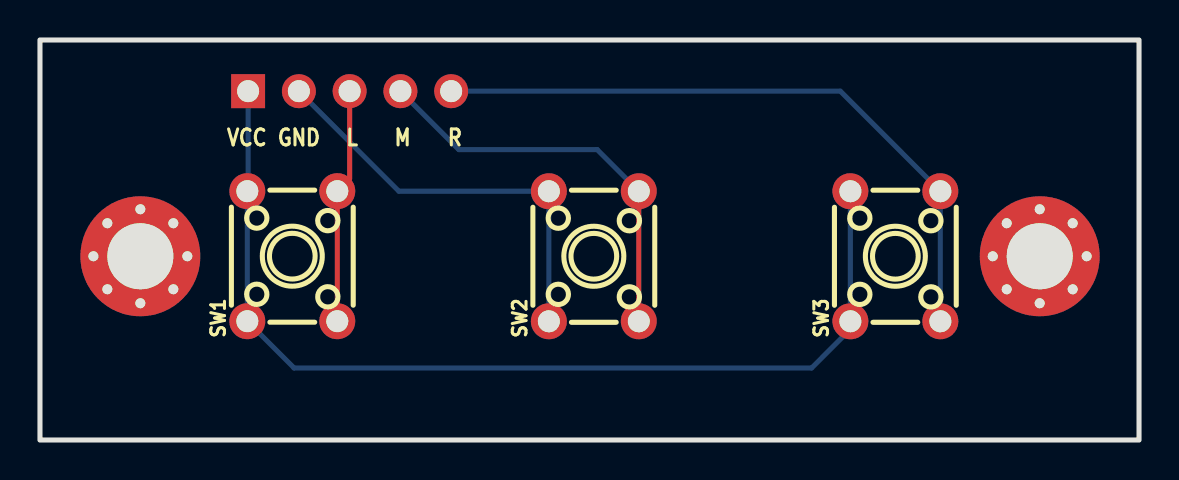
[diagram p5: board, top side]
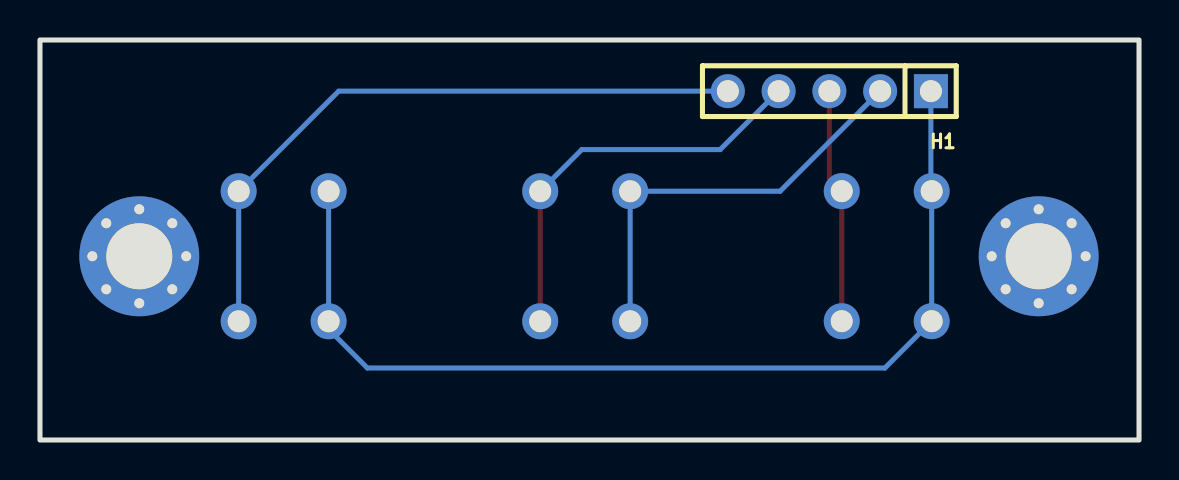
[diagram p6: board, bottom side, seen from below]

Outline 54.99 x 20 mm; copper layers: Top Layer, Bottom Layer. Coordinates in mm from the lower left corner of the outline.
Outline path: rectangle 0,20 54.99,0
Stack: Top Layer 0.035mm / Dielectric1 1.51mm FR4 er 4.5 / Bottom Layer 0.035mm

## Design rules (mm)
template: JLCPCB Capability(Two Layers Board)
spacing copperThickness1oz (default): track to track 0.102, other pairs 0.152 to 0.3
spacing copperThickness2oz: track to track 0.203, other pairs 0.152 to 0.3
track width copperThickness1oz (default): min 0.127, default 0.254, max 2.54
track width copperThickness2oz: min 0.203, default 0.254, max 2.54
differential pair differentialPair (default): width min 0.127, default 0.254, max 2.54; gap min 0.152, default 0.152
via viaSize (default): diameter min 0.5, default 0.61, max 10; hole min 0.3, default 0.305, max 6.3

## Placement (name value [footprint] x y rotation side)
H1  PZ254V-11-05P  [HDR-TH_5P-P2.54-V-M]  15.49 17.44 0 bottom
H2  Hole-3mm-JK 孔  [hole-3mm]  50.02 9.19 0 top
H3  Hole-3mm-JK 孔  [hole-3mm]  5.02 9.19 0 top
SW1  K2-1102DP-C4SW-04  [KEY-TH_4P-L6.0-W6.0-P4.50-LS6.5]  12.62 9.19 90 top
SW2  K2-1102DP-C4SW-04  [KEY-TH_4P-L6.0-W6.0-P4.50-LS6.5]  27.71 9.19 90 top
SW3  K2-1102DP-C4SW-04  [KEY-TH_4P-L6.0-W6.0-P4.50-LS6.5]  42.8 9.19 90 top

## Footprints (pads in the part's own frame, mm; a bottom-side part is the same pattern mirrored in y, then rotated)
HDR-TH_5P-P2.54-V-M
  rect 1.7x1.7 hole 1.1: 1(-5.08,0)
  round 1.7 hole 1.1: 2(-2.54,0) 3(0,0) 4(2.54,0) 5(5.08,0)
hole-3mm
  round 1 hole 0.5: 0(-2.349,0) 0(-1.651,1.651) 0(-1.651,-1.651) 0(0,2.349) 0(0,-2.349) 0(1.651,1.651) 0(1.651,-1.651) 0(2.349,0)
  round 6 hole 3.302x3: 0(0,0)
KEY-TH_4P-L6.0-W6.0-P4.50-LS6.5
  round 1.8 hole 1.1: 1(-3.251,-2.251) 2(3.251,-2.251) 3(3.251,2.251) 4(-3.251,2.251)

## Nets
As in the schematic.

Pads without a net: H2 0; H3 0

## Routing (per net, layer and track width the routed paths; a pad name or vN(x,y) marks a point on that pad's centre or on a via; arc(x,y) is an arc through that point)
GND: length 21.1
  Bottom Layer w0.254: SW2.4 SW2.3 17.96,12.44 H1.2
VCC: length 50.4
  Bottom Layer w0.254: H1.1 10.41,12.48 SW1.3 SW1.4 12.72,3.6 38.61,3.6 40.55,5.54 SW3.4 SW3.3
BTN_LEFT: length 11.8
  Top Layer w0.254: SW1.1 SW1.2 15.49,13.06 H1.3
BTN_MID: length 20.5
  Top Layer w0.254: SW2.2 SW2.1
  Bottom Layer w0.254: SW2.2 27.88,14.52 20.96,14.52 H1.4
BTN_RIGHT: length 33.1
  Bottom Layer w0.254: SW3.1 SW3.2 40.05,17.44 H1.5

## Text on the board
Top Silkscreen Layer: VCC | GND | L | M | R

# Board SHELD
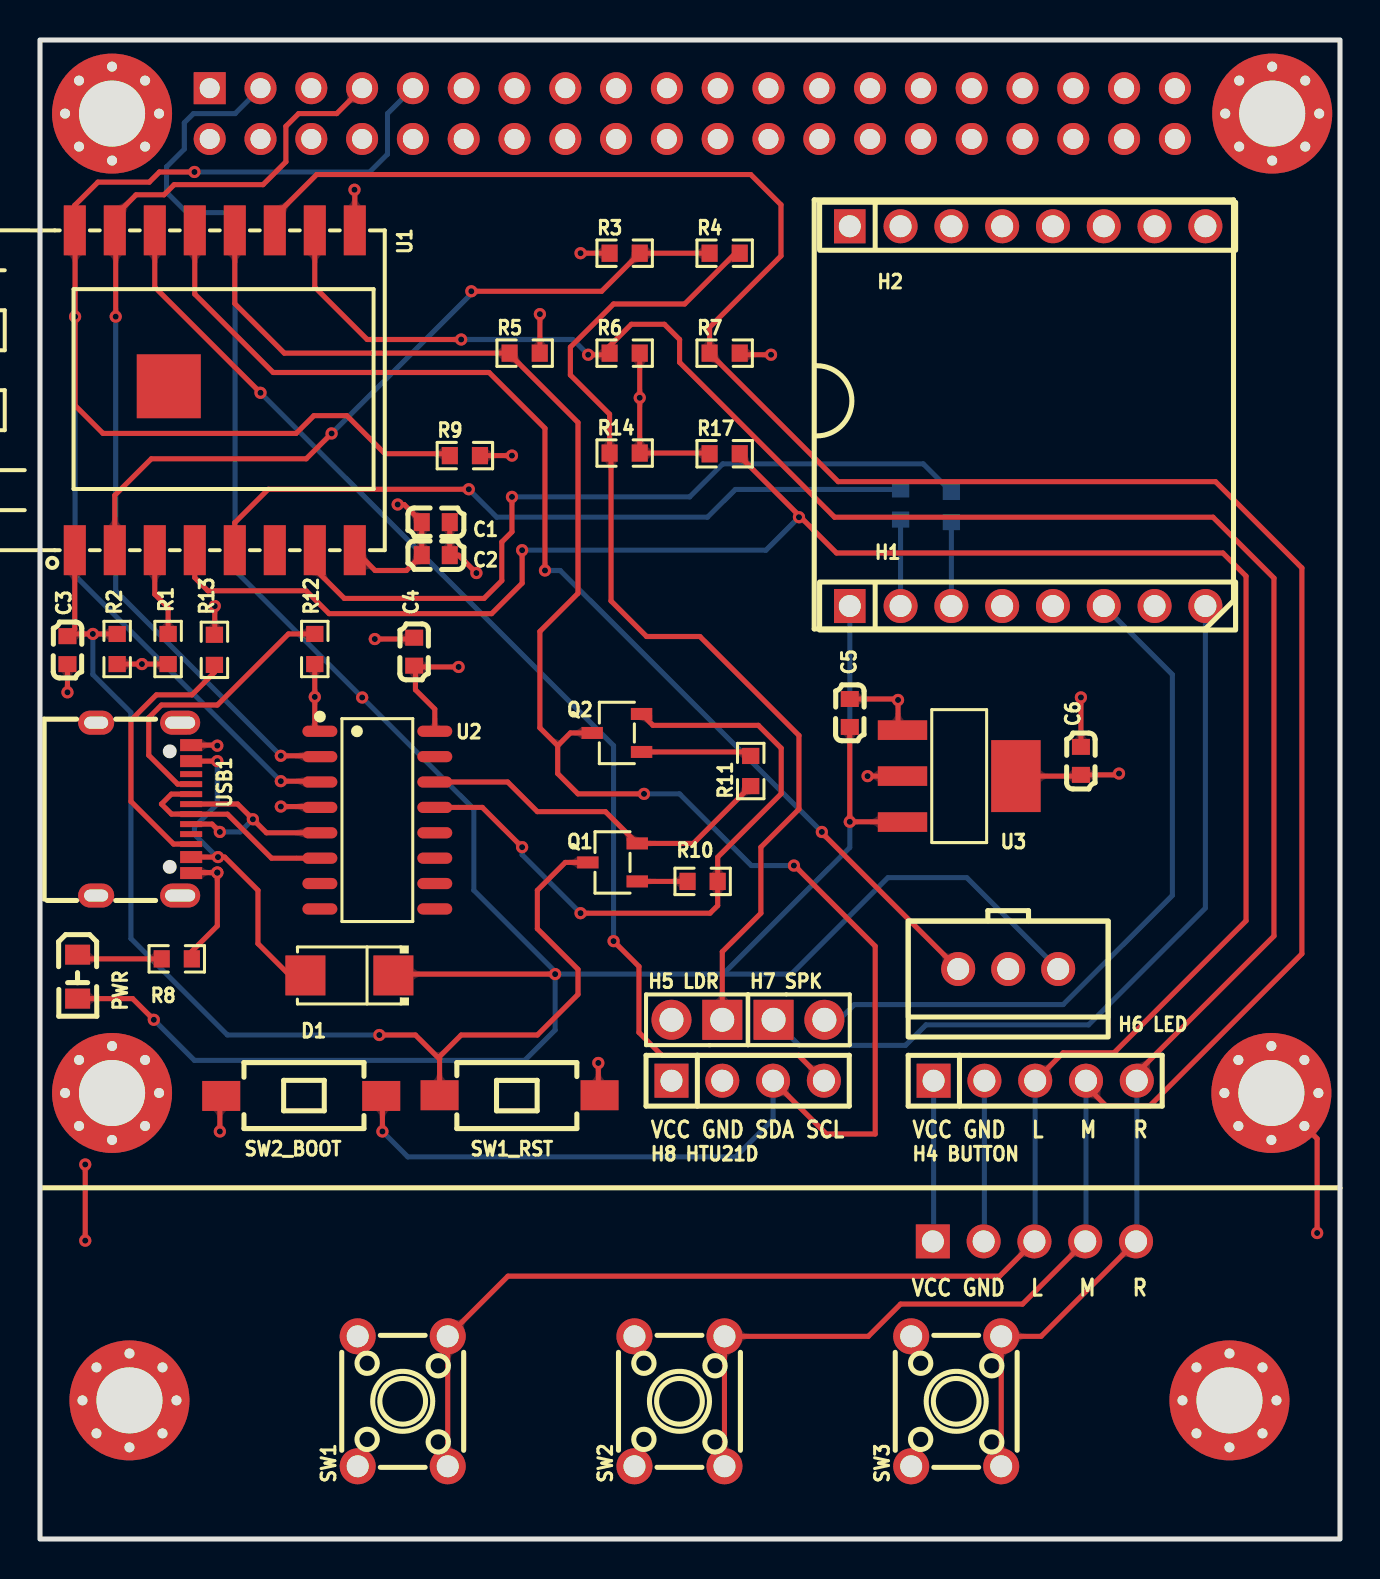
[diagram p7: board, top side]
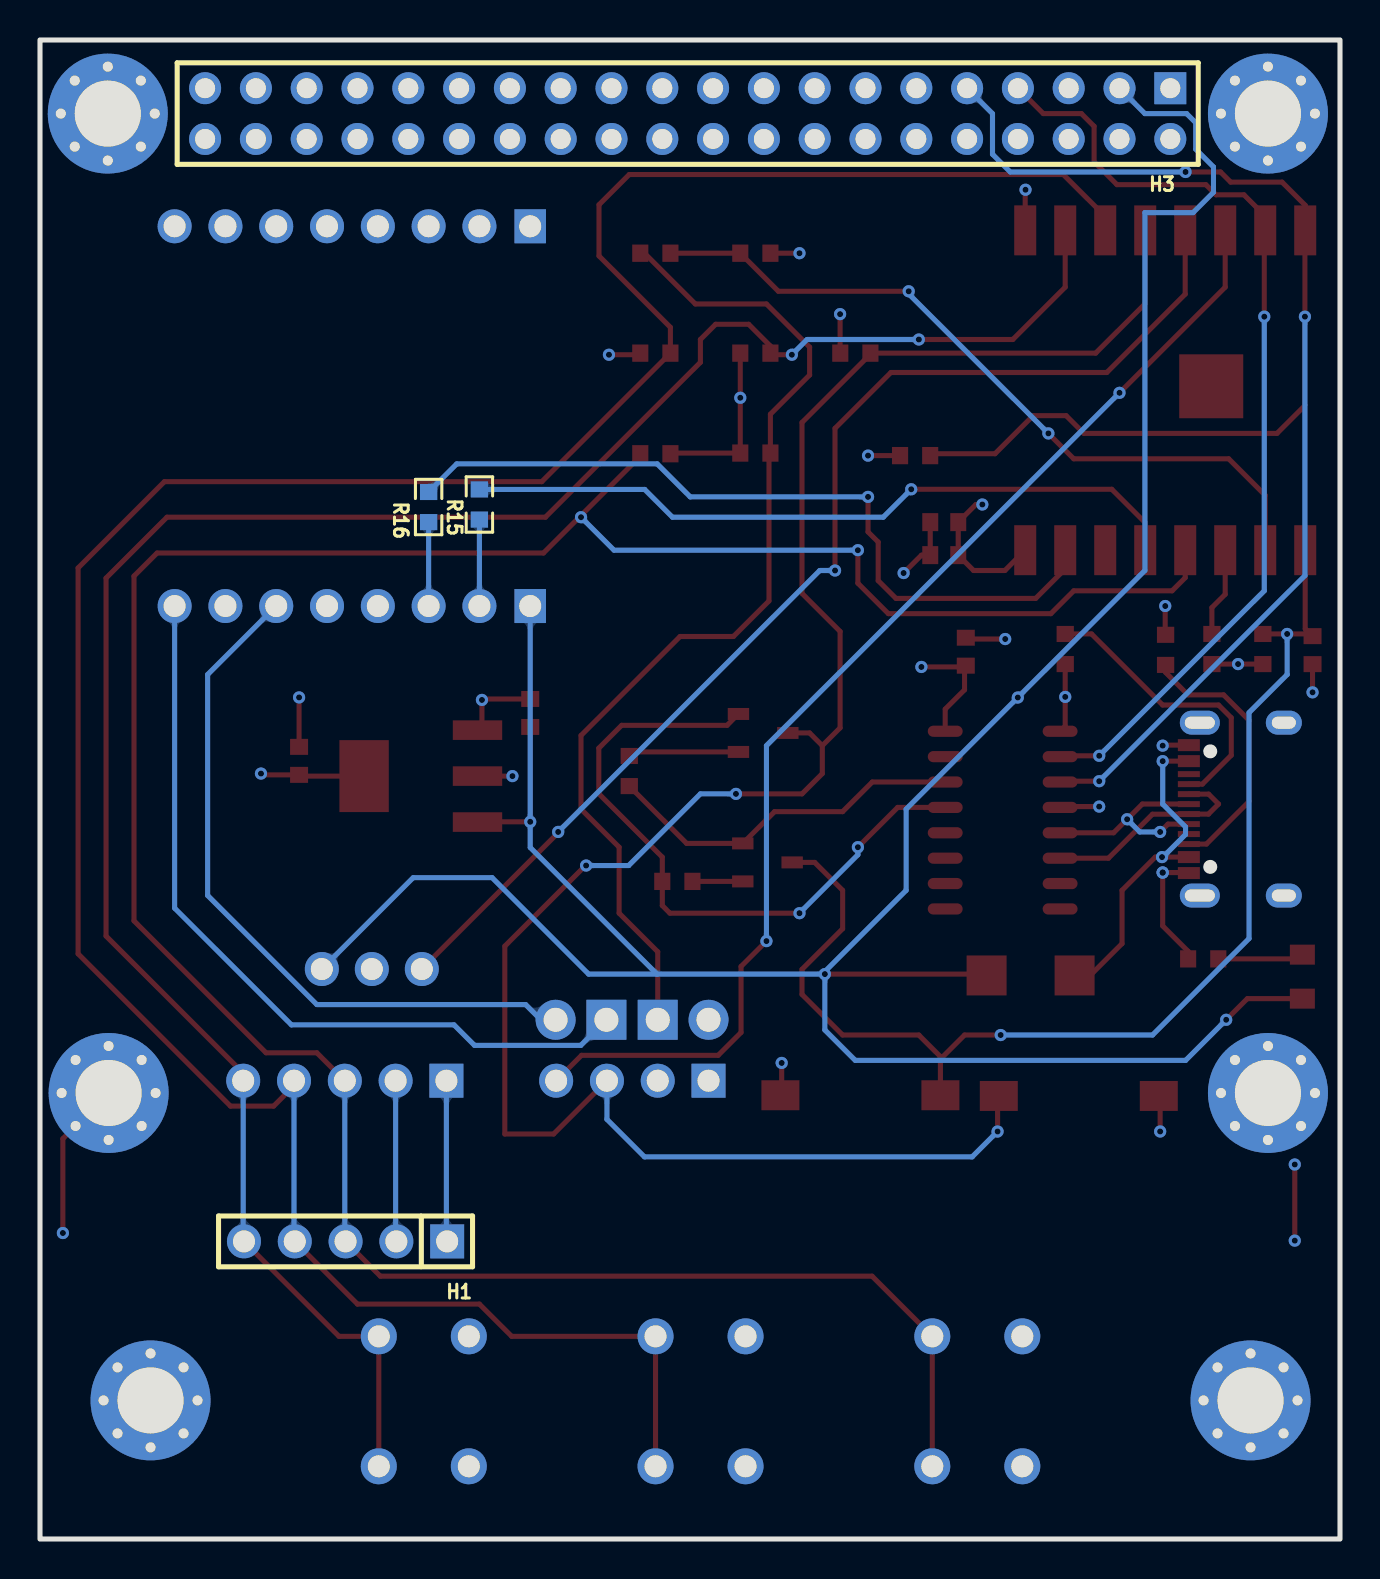
[diagram p8: board, bottom side, seen from below]

Outline 65 x 75 mm; copper layers: Top Layer, GND, VCC, Bottom Layer. Coordinates in mm from the lower left corner of the outline.
Outline path: rectangle 0,75 65,0
Stack: Top Layer 0.035mm 外层铜厚1oz / Dielectric1 0.2104mm 7628 RC49% 8.6mil / GND 0.0152mm 内层铜厚 / Dielectric2 1.065mm 1.1mm H/HOZ 含铜 / VCC 0.0152mm 内层铜厚 / Dielectric3 0.2104mm 7628 RC49% 8.6mil / Bottom Layer 0.035mm 外层铜厚1oz

## Design rules (mm)
net D+: DP1
net D-: DP1
template: JLCPCB Capability(Two Layers Board)
spacing copperThickness1oz (default): track to track 0.102, other pairs 0.152 to 0.3
spacing copperThickness2oz: track to track 0.203, other pairs 0.152 to 0.3
track width copperThickness1oz (default): min 0.127, default 0.254, max 2.54
track width copperThickness2oz: min 0.203, default 0.254, max 2.54
differential pair differentialPair (default): width min 0.127, default 0.254, max 2.54; gap min 0.152, default 0.152
via viaSize (default): diameter min 0.5, default 0.61, max 10; hole min 0.3, default 0.305, max 6.3

## Placement (name value [footprint] x y rotation side)
C1  10uF  [C0603]  19.79 50.88 180 top
C2  100nF  [C0603]  19.79 49.22 180 top
C3  1uF  [C0603]  1.37 44.47 270 top
C4  10nF  [C0603]  18.71 44.39 90 top
C5  10uF  [C0603]  40.49 41.33 270 top
C6  10uF  [C0603]  52.05 38.93 90 top
D1  SS24  [SMA_L4.3-W2.6-LS5.2-RD]  15.47 28.2 180 top
H1  -  [HDR-TH_8P-P2.54-V-F]  49.38 46.68 0 top
H1#2  -  [HDR-TH_5P-P2.54-V-M]  49.72 14.89 0 bottom
H2  -  [HDR-TH_8P-P2.54-V-F]  49.38 65.68 0 top
H2#2  -  [hole-3mm#2]  59.47 6.94 0 top
H3  PM254-2-20-Z-8.5  [hole-3mm#2]  4.47 6.94 0 top
H3#2  -  [HDR-TH_40P-P2.54-V-F-R2-C20-S2.54]  32.61 71.32 0 bottom
H4 BUTTON  PZ254V-11-05P  [HDR-TH_5P-P2.54-V-M]  49.76 22.93 0 top
H5 LDR  PZ254V-11-02P  [HDR-TH_2P-P2.54-V-M]  32.84 25.98 180 top
H6 LED  HC-XHB-3A  [CONN-TH_3P-P2.50_HC-XHB-3AKK]  48.41 28.52 180 top
H7 SPK  PZ254V-11-02P  [HDR-TH_2P-P2.54-V-M]  37.95 25.98 0 top
H8 HTU21D  PZ254V-11-04P  [HDR-TH_4P-P2.54-V-M]  35.38 22.93 0 top
H9  Hole-3mm-JK 孔  [hole-3mm]  3.6 22.32 0 top
H10  Hole-3mm-JK 孔  [hole-3mm]  3.6 71.32 0 top
H11  Hole-3mm-JK 孔  [hole-3mm]  61.61 71.32 0 top
H12  Hole-3mm-JK 孔  [hole-3mm]  61.57 22.32 0 top
PWR  NCD0805R1  [LED0805-RD_RED]  1.88 28.14 270 top
Q1  S8050  [SOT-23-3_L2.9-W1.6-P1.90-LS2.8-BR]  28.63 33.85 0 top
Q2  S8050  [SOT-23-3_L2.9-W1.6-P1.90-LS2.8-BR]  28.84 40.33 0 top
R1  10kΩ  [R0603]  6.41 44.53 90 top
R2  10kΩ  [R0603]  3.86 44.53 90 top
R3  100kΩ  [R0603]  29.23 64.33 0 top
R4  220kΩ  [R0603]  34.23 64.33 0 top
R5  10kΩ  [R0603]  24.23 59.33 0 top
R6  10kΩ  [R0603]  29.23 59.33 0 top
R7  10kΩ  [R0603]  34.23 59.33 0 top
R8  10kΩ  [R0603]  6.84 29.03 0 top
R9  10kΩ  [R0603]  21.24 54.2 0 top
R10  10kΩ  [R0603]  33.13 32.9 180 top
R11  10kΩ  [R0603]  35.54 38.42 90 top
R12  5.1kΩ  [R0603]  13.74 44.53 90 top
R13  5.1kΩ  [R0603]  8.72 44.49 270 top
R14  1kΩ  [R0603]  29.23 54.33 0 top
R15  1kΩ  [R0603]  43.03 51.76 270 bottom
R16  1kΩ  [R0603]  45.57 51.63 270 bottom
R17  10kΩ  [R0603]  34.23 54.3 0 top
SW1  TS-1101-C-W  [KEY-TH_4P-L6.0-W6.0-P4.50-LS6.5]  18.14 6.89 90 top
SW1_RST  TS-1101-C-W  [SW-SMD_L6.0-W3.3-LS8.0]  23.98 22.2 0 top
SW2  TS-1101-C-W  [KEY-TH_4P-L6.0-W6.0-P4.50-LS6.5]  31.97 6.89 90 top
SW2_BOOT  TS-1101-C-W  [SW-SMD_L6.0-W3.3-LS8.0]  13.06 22.17 180 top
SW3  K2-1102DP-C4SW-04  [KEY-TH_4P-L6.0-W6.0-P4.50-LS6.5]  45.81 6.89 90 top
U1  2.4GHz  [WIRELM-SMD_ESP-12S]  8.74 57.47 90 top
U2  CH340C  [SOP-16_L10.0-W3.9-P1.27-LS6.0-BL]  16.87 35.97 270 top
U3  AMS1117-3.3  [SOT-223-4_L6.5-W3.5-P2.30-LS7.0-BR]  45.96 38.17 180 top
USB1  TYPE-C 16PIN 2MD(073)  [USB-C-SMD_TYPE-C-6PIN-2MD-073]  5.18 36.52 270 top

## Footprints (pads in the part's own frame, mm; a bottom-side part is the same pattern mirrored in y, then rotated)
C0603
  rect 0.8x0.9 smd: 1(-0.7,0) 2(0.7,0)
CONN-TH_3P-P2.50_HC-XHB-3AKK
  round 1.7 hole 1.1: 1(-2.5,0) 2(0,0) 3(2.5,0)
HDR-TH_2P-P2.54-V-M
  rect 2x2 hole 1.2: 1(-1.27,0)
  round 2 hole 1.2: 2(1.27,0)
HDR-TH_4P-P2.54-V-M
  rect 1.7x1.7 hole 1.1: 1(-3.81,0)
  round 1.7 hole 1.1: 2(-1.27,0) 3(1.27,0) 4(3.81,0)
HDR-TH_5P-P2.54-V-M
  rect 1.7x1.7 hole 1.1: 1(-5.08,0)
  round 1.7 hole 1.1: 2(-2.54,0) 3(0,0) 4(2.54,0) 5(5.08,0)
HDR-TH_8P-P2.54-V-F
  rect 1.575x1.7 hole 1.1: 1(-8.89,0)
  round 1.7 hole 1.1: 2(-6.35,0) 3(-3.81,0) 4(-1.27,0) 5(1.27,0) 6(3.81,0) 7(6.35,0) 8(8.89,0)
HDR-TH_40P-P2.54-V-F-R2-C20-S2.54
  rect 1.6x1.6 hole 1: 1(-24.13,-1.27)
  round 1.6 hole 1: 2(-24.13,1.27) 3(-21.59,-1.27) 4(-21.59,1.27) 5(-19.05,-1.27) 6(-19.05,1.27) 7(-16.51,-1.27) 8(-16.51,1.27) 9(-13.97,-1.27) 10(-13.97,1.27) 11(-11.43,-1.27) 12(-11.43,1.27) 13(-8.89,-1.27) 14(-8.89,1.27) 15(-6.35,-1.27) 16(-6.35,1.27) 17(-3.81,-1.27) 18(-3.81,1.27) 19(-1.27,-1.27) 20(-1.27,1.27) 21(1.27,-1.27) 22(1.27,1.27) 23(3.81,-1.27) 24(3.81,1.27) 25(6.35,-1.27) 26(6.35,1.27) 27(8.89,-1.27) 28(8.89,1.27) 29(11.43,-1.27) 30(11.43,1.27) 31(13.97,-1.27) 32(13.97,1.27) 33(16.51,-1.27) 34(16.51,1.27) 35(19.05,-1.27) 36(19.05,1.27) 37(21.59,-1.27) 38(21.59,1.27) 39(24.13,-1.27) 40(24.13,1.27)
hole-3mm
  round 1 hole 0.5: 0(-2.349,0) 0(-1.651,1.651) 0(-1.651,-1.651) 0(0,2.349) 0(0,-2.349) 0(1.651,1.651) 0(1.651,-1.651) 0(2.349,0)
  round 6 hole 3.302x2.75: 0(0,0)
hole-3mm#2
  round 1 hole 0.5: 0(-2.349,0) 0(-1.651,1.651) 0(-1.651,-1.651) 0(0,2.349) 0(0,-2.349) 0(1.651,1.651) 0(1.651,-1.651) 0(2.349,0)
  round 6 hole 3.302x3: 0(0,0)
KEY-TH_4P-L6.0-W6.0-P4.50-LS6.5
  round 1.8 hole 1.1: 1(-3.251,-2.251) 2(3.251,-2.251) 3(3.251,2.251) 4(-3.251,2.251)
LED0805-RD_RED
  rect 1x1.25 smd: 1(-1.1,0) 2(1.1,0)
R0603
  rect 0.806x0.864 smd: 1(-0.753,0) 2(0.753,0)
SMA_L4.3-W2.6-LS5.2-RD
  rect 2x2 smd: 1(-2.2,0) 2(2.2,0)
SOP-16_L10.0-W3.9-P1.27-LS6.0-BL
  oval 0.56x1.745 smd: 1(-4.445,-2.873) 2(-3.175,-2.873) 3(-1.905,-2.873) 4(-0.635,-2.873) 5(0.635,-2.873) 6(1.905,-2.873) 7(3.175,-2.873) 8(4.445,-2.873) 9(4.445,2.873) 10(3.175,2.873) 11(1.905,2.873) 12(0.635,2.873) 13(-0.635,2.873) 14(-1.905,2.873) 15(-3.175,2.873) 16(-4.445,2.873)
SOT-23-3_L2.9-W1.6-P1.90-LS2.8-BR
  rect 1.07x0.6 smd: 1(1.235,-0.95) 2(1.235,0.95) 3(-1.235,0)
SOT-223-4_L6.5-W3.5-P2.30-LS7.0-BR
  rect 2.47x0.98 smd: 1(2.835,-2.3) 2(2.835,0) 3(2.835,2.3)
  rect 2.47x3.6 smd: 4(-2.835,0)
SW-SMD_L6.0-W3.3-LS8.0
  rect 1.9x1.5 smd: 1(-4,0) 2(4,0)
USB-C-SMD_TYPE-C-6PIN-2MD-073
  rect 0.6x1.1 smd: 1(-3.2,2.375) 2(-2.4,2.375) 11(2.4,2.375) 12(3.2,2.375)
  rect 0.3x1.1 smd: 3(-1.75,2.375) 4(-1.25,2.375) 5(-0.75,2.375) 6(-0.25,2.375) 7(0.25,2.375) 8(0.75,2.375) 9(1.25,2.375) 10(1.75,2.375)
  oval 1.2x2 hole 0.6x1.5: 13(-4.325,1.825) 14(4.325,1.825)
  oval 1.2x1.8 hole 0.6x1.2: 13(-4.325,-2.375) 14(4.325,-2.375)
WIRELM-SMD_ESP-12S
  rect 2.5x1.1 smd: 1(-8.002,7) 2(-8.002,5) 3(-8,3) 4(-8.002,1) 5(-8.002,-1) 6(-8.002,-3) 7(-8.002,-5) 8(-8.001,-7) 9(8.001,-7) 10(8,-5) 11(8.001,-3) 12(8,-1) 13(8.001,1) 14(8.002,3) 15(8.001,5) 16(8,7)
  rect 3.2x3.2 smd: 17(0.2,2.3)

## Nets
+5V: C5.2 D1.1 H1.1 H3#2.3 H6 LED.1 PWR.2 U3.3
GND: C1.1 C2.1 C3.2 C4.2 C5.1 C6.2 H1.7 H1#2.2 H2.7 H3#2.5 H4 BUTTON.2 H6 LED.2 H8 HTU21D.2 R3.1 R6.2 R8.2 R12.1 R13.1 R14.2 R17.1 SW1_RST.2 SW2.3 SW2.4 SW2_BOOT.2 U1.9 U2.1 U3.1 USB1.1 USB1.12
VBUS: D1.2 USB1.2 USB1.11
VCC: C1.2 C2.2 C4.1 C6.1 H1#2.1 H4 BUTTON.1 H5 LDR.2 H8 HTU21D.1 R1.1 R2.1 R5.2 R7.2 R9.2 SW1.3 SW1.4 SW3.3 SW3.4 U1.8 U2.4 U2.16 U3.2 U3.4
ADC: R3.2 R4.1 U1.2
ADC_EX: H5 LDR.1 R4.2 R14.1
BOOT: H8 HTU21D.3 Q2.3 R5.1 SW2_BOOT.1 U1.12
BTN_LEFT: H1#2.3 H4 BUTTON.3 R17.2 SW1.1 SW1.2 U1.4
BTN_MID: H1#2.4 H4 BUTTON.4 R7.1 SW2.1 SW2.2 U1.11
BTN_RIGHT: H1#2.5 H4 BUTTON.5 R6.1 SW3.1 SW3.2 U1.10
D+: U2.5 USB1.6 USB1.8
D-: U2.6 USB1.5 USB1.7
EN: R1.2 U1.3
LED: H6 LED.3 U1.13
RST: C3.1 Q1.3 R2.2 SW1_RST.1 U1.1
RX_ESP: H3#2.7 U1.15 U2.2
RX_SOFT: R16.1 U1.7
SCL: H8 HTU21D.4 U1.14
TX_ESP: H3#2.9 R9.1 U1.16 U2.3
TX_SOFT: R15.1 U1.5
$1N1623: PWR.1 R8.1
$1N2237: Q1.2 R11.1 U2.14
$1N2263: Q2.2 R10.1 U2.13
$1N2841: Q1.1 R10.2
$1N2976: Q2.1 R11.2
$1N3870: R12.2 USB1.4
$1N3955: R13.2 USB1.10
$1N4962: H1.2 R15.2
$1N4965: H1.3 R16.2
$1N6761: H1.6 H7 SPK.2
$1N6766: H1.8 H7 SPK.1

Pads without a net: H1 4 5; H2 1 2 3 4 5 6 8; H2#2 0; H3 0; H3#2 1 2 4 6 8 10 11 12 13 14 15 16 17 18 19 20 21 22 23 24 25 26 27 28 29 30 31 32 33 34 35 36 37 38 39 40; H9 0; H10 0; H11 0; H12 0; U1 6 17; U2 7 8 9 10 11 12 15; USB1 3 9 13 14

## Via types
v1: diameter 0.61, hole 0.305, Top Layer to Bottom Layer, 59 vias

## Routing (per net, layer and track width the routed paths; a pad name or vN(x,y) marks a point on that pad's centre or on a via; arc(x,y) is an arc through that point)
+5V: length 150.7
  Top Layer w0.254: C5.2 v1(40.49,35.88) 42.74,35.88 42.75,35.87 ; D1.1 17.74,28.26 v1(25.76,28.26) ; v1(5.69,25.98) 4.63,27.04 PWR.2
  Bottom Layer w0.254: 34.15,28.26 37.57,28.26 42.39,33.09 46.34,33.09 H6 LED.1 ; 34.15,28.26 v1(25.76,28.26) ; 34.15,28.26 40.49,34.6 v1(40.49,35.88) H1.1 ; H3#2.3 9.76,71.32 7.67,71.32 7.22,70.86 7.22,69.54 6.33,68.65 6.33,67.38 7.34,66.36 9.76,66.36 9.76,48.46 v1(16.11,42.1) 21.69,36.52 21.69,32.45 25.76,28.39 v1(25.76,28.26) ; v1(25.76,28.26) 25.76,25.47 24.23,23.95 7.72,23.95 v1(5.69,25.98)
GND: length 49.2
  Top Layer w0.254: R8.2 7.59,29.4 8.87,30.68 v1(8.87,33.34) 7.58,33.34 USB1.12 ; v1(8.99,20.39) 8.99,22.1 SW2_BOOT.2 ; 42.75,40.47 42.9,40.62 v1(42.9,41.98) 42.85,42.03 C5.1 ; C4.2 18.64,45.03 v1(16.74,45.03) ; v1(8.74,46.68) 8.74,45.26 R13.1 ; U1.9 15.74,67.49 v1(15.72,67.51) ; v1(21.82,48.33) 20.93,49.22 C2.1 C1.1 ; v1(1.37,42.36) C3.2 ; SW1_RST.2 27.92,22.27 v1(27.92,23.82) ; C6.2 v1(52.05,42.11) ; v1(27.03,64.33) R3.1 ; v1(8.87,39.69) 8.84,39.72 USB1.1 ; 33.48,54.17 33.32,54.33 R14.2 v1(29.99,57.1) R6.2 ; U2.1 13.74,40.67 v1(13.74,42.13) R12.1
  Bottom Layer w0.254: H4 BUTTON.2 47.22,14.93 H1#2.2
VBUS: length 16.8
  Top Layer w0.254: USB1.2 v1(8.87,38.92) ; USB1.11 v1(8.9,34.12) 9.23,34.12 10.9,32.45 10.9,29.79 12.49,28.2 D1.2
  Bottom Layer w0.254: v1(8.87,38.92) 8.87,36.77 7.72,35.63 7.72,35.25 8.87,34.11
VCC: length 37.5
  Top Layer w0.254: 18.77,43.63 18.77,42.49 19.74,41.52 U2.16 ; 18.77,43.63 C4.1 ; 18.77,43.63 v1(20.93,43.63) ; v1(17.88,51.76) 18.2,51.76 C1.2 C2.2 18.32,48.46 16.76,48.46 U1.8 ; U2.4 13.95,36.65 v1(12.04,36.65) ; R9.2 v1(23.6,54.2) ; U3.4 51.98,38.17 C6.1 53.89,38.23 v1(53.95,38.3) ; v1(36.55,59.25) 35.07,59.25 R7.2 ; R5.2 24.99,59.34 v1(24.99,61.28) ; R1.1 v1(5.1,43.78) R2.1 ; v1(41.38,38.17) 42.75,38.17
  Bottom Layer w0.254: H4 BUTTON.1 44.68,14.93 H1#2.1
(no net): length 11.8
  Top Layer w0.254: v1(63.86,15.31) 63.86,20.03 H12.0 H12.0 ; v1(2.26,14.93) v1(2.26,18.74)
ADC: length 37.6
  Top Layer w0.254: v1(21.57,62.43) 28.08,62.43 R3.2 R4.1 ; U1.2 3.74,52.22 5.56,54.04 13.31,54.04 v1(14.58,55.31)
  Bottom Layer w0.254: v1(14.58,55.31) 21.57,62.3 v1(21.57,62.43)
ADC_EX: length 52
  Top Layer w0.254: R4.2 34.77,64.33 32.23,61.79 28.68,61.79 26.52,59.63 26.52,58.24 28.48,56.28 R14.1 28.55,54.26 28.55,46.93 30.33,45.15 33,45.15 37.95,40.2 37.95,36.52 36.04,34.61 36.04,31.31 34.11,29.38 H5 LDR.1
BOOT: length 103.7
  Top Layer w0.254: v1(17.12,20.39) 17.12,22.11 SW2_BOOT.1 ; U1.12 9.74,61.81 12.22,59.33 R5.1 23.48,59.28 26.9,55.86 26.9,47.31 24.99,45.41 24.99,40.58 25.88,39.69 ; v1(30.2,37.28) 26.9,37.28 25.88,38.3 25.88,39.69 ; 25.88,39.69 26.52,40.33 Q2.3 ; H8 HTU21D.3 39.32,20.26 41.76,20.26 41.76,29.66 37.72,33.7 v1(37.7,33.7)
  Bottom Layer w0.254: v1(17.12,20.39) 18.39,19.12 34.77,19.12 36.65,21 H8 HTU21D.3 ; v1(30.2,37.28) 31.98,37.28 35.57,33.7 v1(37.7,33.7)
BTN_LEFT: length 140.1
  Top Layer w0.254: H1#2.3 47.98,13.15 23.4,13.15 SW1.2 SW1.1 ; 34.99,54.17 39.83,49.33 59.14,49.33 60.3,48.18 60.3,30.93 53.7,24.33 51.16,24.33 H4 BUTTON.3 ; v1(24.11,49.47) 24.11,47.82 22.58,46.3 14.45,46.3 13.31,47.44 8.39,47.44 7.74,48.1 U1.4
  Bottom Layer w0.254: H4 BUTTON.3 49.76,14.93 H1#2.3 ; v1(24.11,49.47) 36.3,49.47 v1(37.95,51.12)
BTN_MID: length 139
  Top Layer w0.254: H1#2.4 49.13,11.75 43.03,11.75 41.42,10.14 SW2.2 SW2.1 ; H4 BUTTON.4 52.3,22.68 53.32,21.66 55.48,21.66 63.1,29.28 63.1,48.58 58.78,52.9 39.91,52.9 R7.1 33.48,60.62 37.05,64.19 37.05,66.76 35.54,68.27 13.83,68.27 11.74,66.17 U1.11
  Bottom Layer w0.254: H1#2.4 52.3,14.93 H4 BUTTON.4
BTN_RIGHT: length 110.2
  Top Layer w0.254: SW3.1 SW3.2 50.05,10.14 H1#2.5 ; U1.10 13.74,62.63 16.36,60.01 v1(21.06,60.01) ; v1(27.41,59.25) 28.4,59.25 R6.1 28.48,59.69 29.57,60.78 31.22,60.78 31.98,60.01 31.98,58.87 39.73,51.12 58.65,51.12 61.7,48.08 61.7,30.17 54.84,23.31 H4 BUTTON.5
  Bottom Layer w0.254: H4 BUTTON.5 54.84,14.93 H1#2.5 ; v1(21.06,60.01) 26.65,60.01 v1(27.41,59.25)
D+: length 10.5
  Top Layer w0.254: U2.5 11.32,35.33 v1(10.64,36.01) 9.88,36.77 7.56,36.77 USB1.6 ; USB1.8 8.6,35.77 v1(8.99,35.38)
  Bottom Layer w0.254: v1(8.99,35.38) 10.01,35.38 v1(10.64,36.01)
D-: length 10.7
  Top Layer w0.254: U2.6 11.58,34.06 9.37,36.26 7.56,36.26 USB1.7 6.58,36.27 6.07,36.77 6.57,37.27 USB1.5
EN: length 4.5
  Top Layer w0.254: U1.3 5.74,47.27 6.41,46.6 R1.2
LED: length 59.5
  Top Layer w0.254: H6 LED.3 39.09,35.34 v1(39.09,35.38) ; U1.13 7.74,62.28 11.66,58.36 22.45,58.36 25.25,55.57 v1(25.25,48.46)
  Bottom Layer w0.254: v1(39.09,35.38) 26.01,48.46 v1(25.25,48.46)
RST: length 60.1
  Top Layer w0.254: 19.98,24.01 SW1_RST.1 ; 19.98,24.01 18.77,25.22 v1(16.97,25.22) ; 19.98,24.01 19.98,24.14 21.06,25.22 24.87,25.22 26.9,27.25 26.9,28.5 24.87,30.53 24.87,32.45 26.27,33.85 Q1.3 ; 1.48,45.28 1.74,45.54 U1.1 ; 1.48,45.28 v1(2.64,45.28) R2.2 ; 1.48,45.28 C3.1
  Bottom Layer w0.254: v1(2.64,45.28) 2.64,43.25 4.55,41.34 4.55,30.04 9.37,25.22 v1(16.97,25.22)
RX_ESP: length 48.5
  Top Layer w0.254: U2.2 13.95,39.19 v1(12.04,39.19) ; H3#2.7 14.83,71.32 12.93,71.32 12.3,70.68 12.3,68.9 11.15,67.76 6.71,67.76 6.2,67.25 4.8,67.25 3.74,66.19 U1.15 3.79,65.43 v1(3.79,61.16)
  Bottom Layer w0.254: v1(12.04,39.19) 3.79,47.44 v1(3.79,61.16)
RX_SOFT: length 38.9
  Top Layer w0.254: v1(23.6,52.14) 23.6,50.39 23.09,49.88 23.09,47.95 22.2,47.06 15.22,47.06 13.74,48.54 U1.7
  Bottom Layer w0.254: R16.1 44.16,53.79 34.14,53.79 32.49,52.14 v1(23.6,52.14)
SCL: length 60.4
  Top Layer w0.254: v1(11.02,57.35) 5.74,62.63 U1.14 ; H8 HTU21D.4 37.92,24.2 31.09,24.2 29.95,25.34 29.95,28.64 v1(28.68,29.91)
  Bottom Layer w0.254: v1(11.02,57.35) 28.68,39.69 v1(28.68,29.91)
TX_ESP: length 80.2
  Top Layer w0.254: 20.23,54.3 17.25,54.3 15.34,56.2 13.69,56.2 12.8,55.31 3.15,55.31 1.75,56.71 v1(1.75,61.16) 1.75,65.46 U1.16 1.74,66.73 2.9,67.89 5.47,67.89 5.97,68.4 v1(7.72,68.4) ; U2.3 13.95,37.92 v1(12.04,37.92)
  Bottom Layer w0.254: H3#2.9 17.38,71.32 17.38,69.28 16.49,68.4 v1(7.72,68.4) ; v1(12.04,37.92) 1.75,48.2 v1(1.75,61.16)
TX_SOFT: length 36.5
  Top Layer w0.254: U1.5 9.74,50.85 11.41,52.52 v1(21.44,52.52)
  Bottom Layer w0.254: R15.1 34.77,52.51 33.38,51.12 22.84,51.12 v1(21.44,52.52)
$1N1623: length 4.3
  Top Layer w0.254: PWR.1 2.09,29.03 6.08,29.03
$1N2237: length 18.3
  Top Layer w0.254: U2.14 23.39,37.87 24.87,36.39 28.27,36.39 Q1.2 32.67,34.8 R11.1
$1N2263: length 33.6
  Top Layer w0.254: v1(27.03,31.31) 33.5,31.31 33.89,31.69 R10.1 33.89,34.12 37.06,37.29 37.06,39.57 35.92,40.71 30.65,40.71 Q2.2 ; U2.13 22.12,36.6 v1(24.11,34.61)
  Bottom Layer w0.254: v1(27.03,31.31) 24.11,34.23 v1(24.11,34.61)
$1N2841: length 2.5
  Top Layer w0.254: Q1.1 R10.2
$1N2976: length 5.5
  Top Layer w0.254: Q2.1 35.33,39.38 R11.2
$1N3870: length 14.6
  Top Layer w0.254: R12.2 12.42,45.28 8.87,41.73 6.07,41.73 5.44,41.09 5.44,39.21 6.88,37.77 USB1.4
$1N3955: length 13.5
  Top Layer w0.254: R13.2 8.72,43.36 7.6,42.23 5.82,42.23 4.55,40.96 4.55,36.9 6.68,34.77 USB1.10
$1N4962: length 4.2
  Bottom Layer w0.254: 43.03,50.88 H1.2
$1N4965: length 4.2
  Bottom Layer w0.254: R16.2 H1.3
$1N6761: length 35.9
  Bottom Layer w0.254: H1.6 56.62,43.25 56.62,32.2 51.16,26.74 40.72,26.74 39.95,25.98 H7 SPK.2
$1N6766: length 40.1
  Bottom Layer w0.254: H1.8 58.27,31.57 52.43,25.72 44.3,25.72 43.27,24.7 37.96,24.7 H7 SPK.1

## Copper pours and planes (outline as drawn; the poured copper is in the pictures)
GND on GND: 0.26,74.74 64.74,74.74 64.74,0.26 0.26,0.26
VCC on VCC: 0.26,74.74 64.74,74.74 64.74,0.26 0.26,0.26

Small or netless copper shapes (teardrops, artwork), in the pictures only: 202 on Top Layer, 61 on Bottom Layer, 36 on GND, 31 on VCC

## Text on the board
Top Silkscreen Layer: VCC | GND | SDA | SCL | L | M | R
